# EAGLE design powerboard (EAGLE 7.1.0)
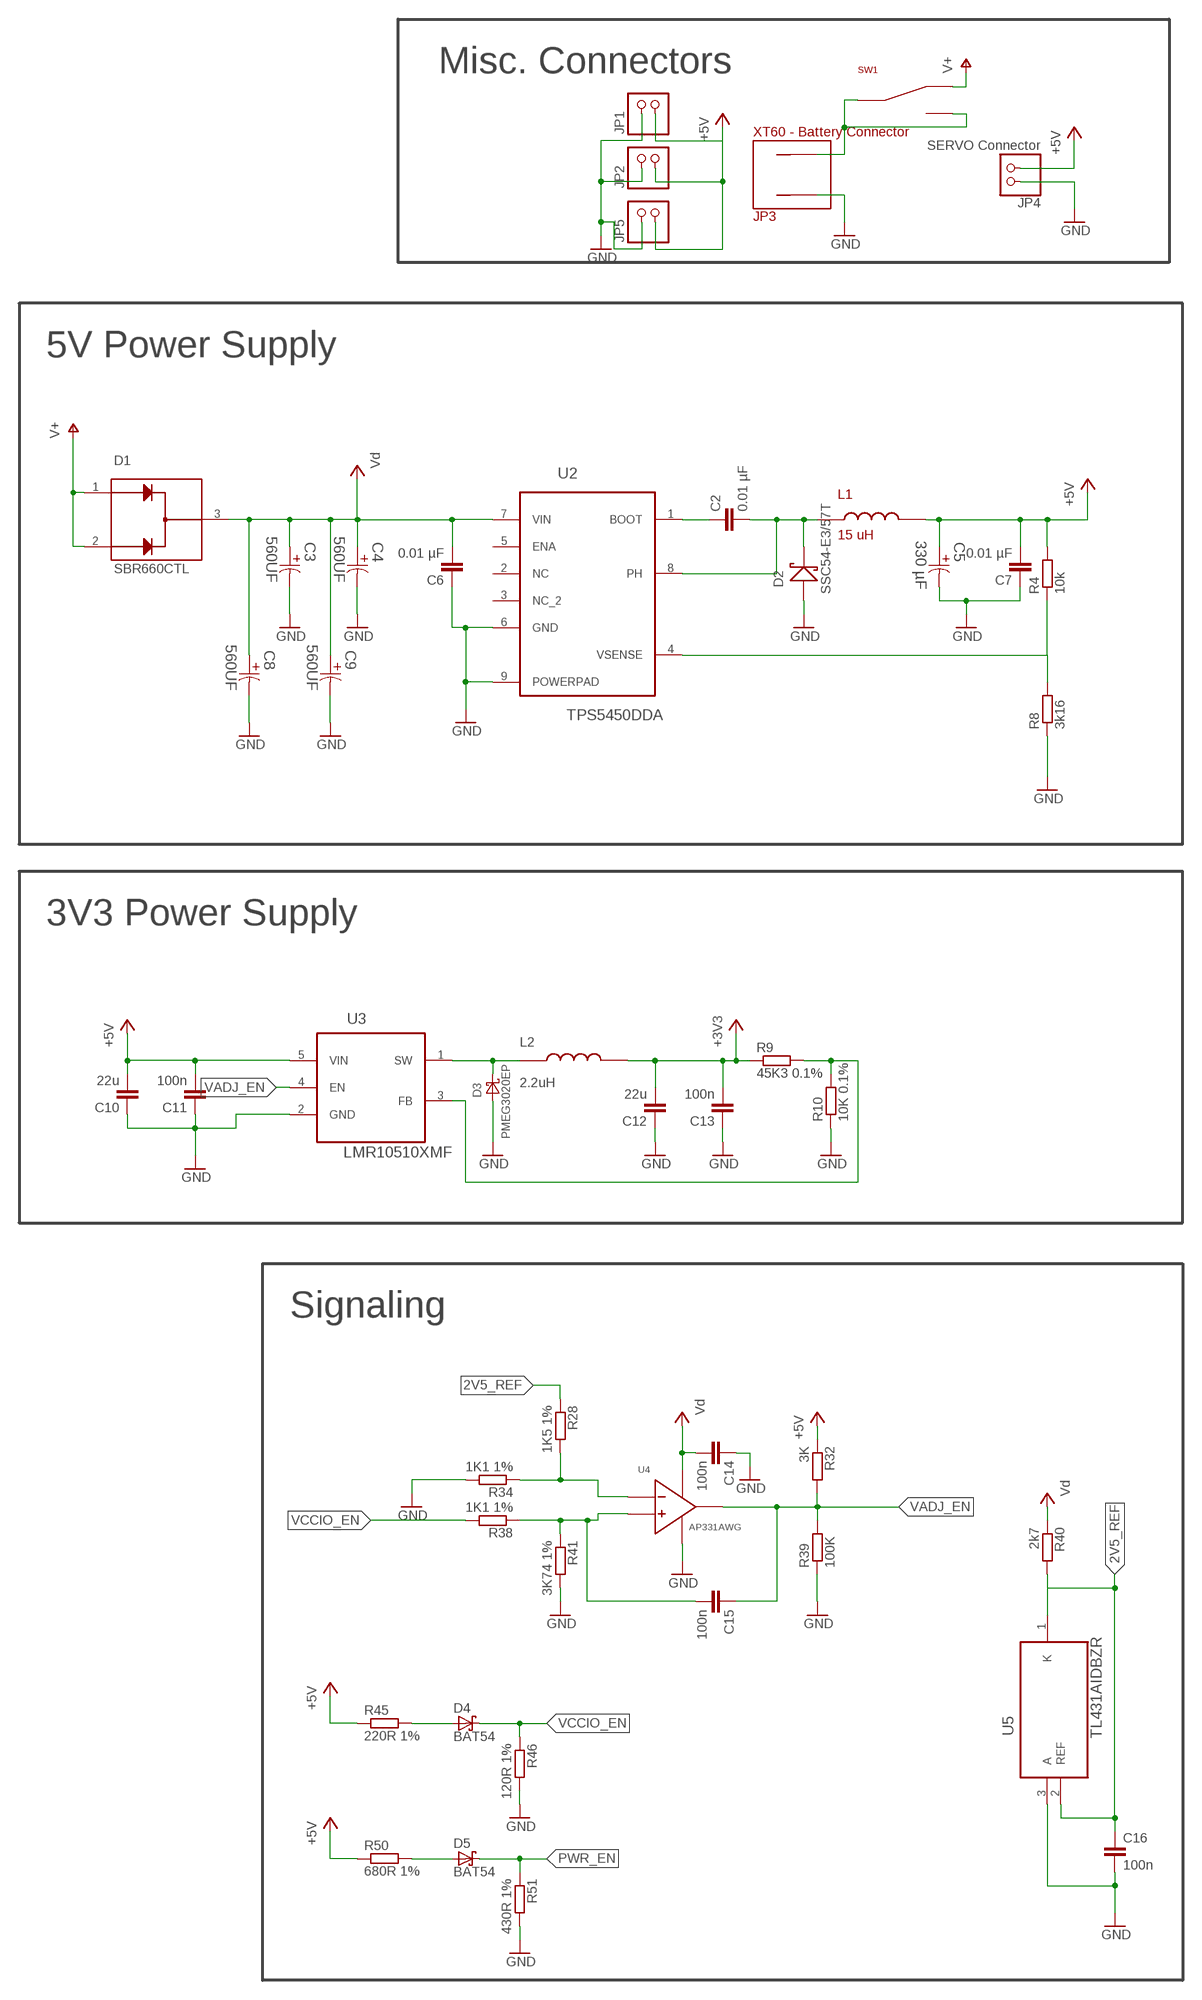
[diagram p0: schematic, sheet 1, part 1 of 2]
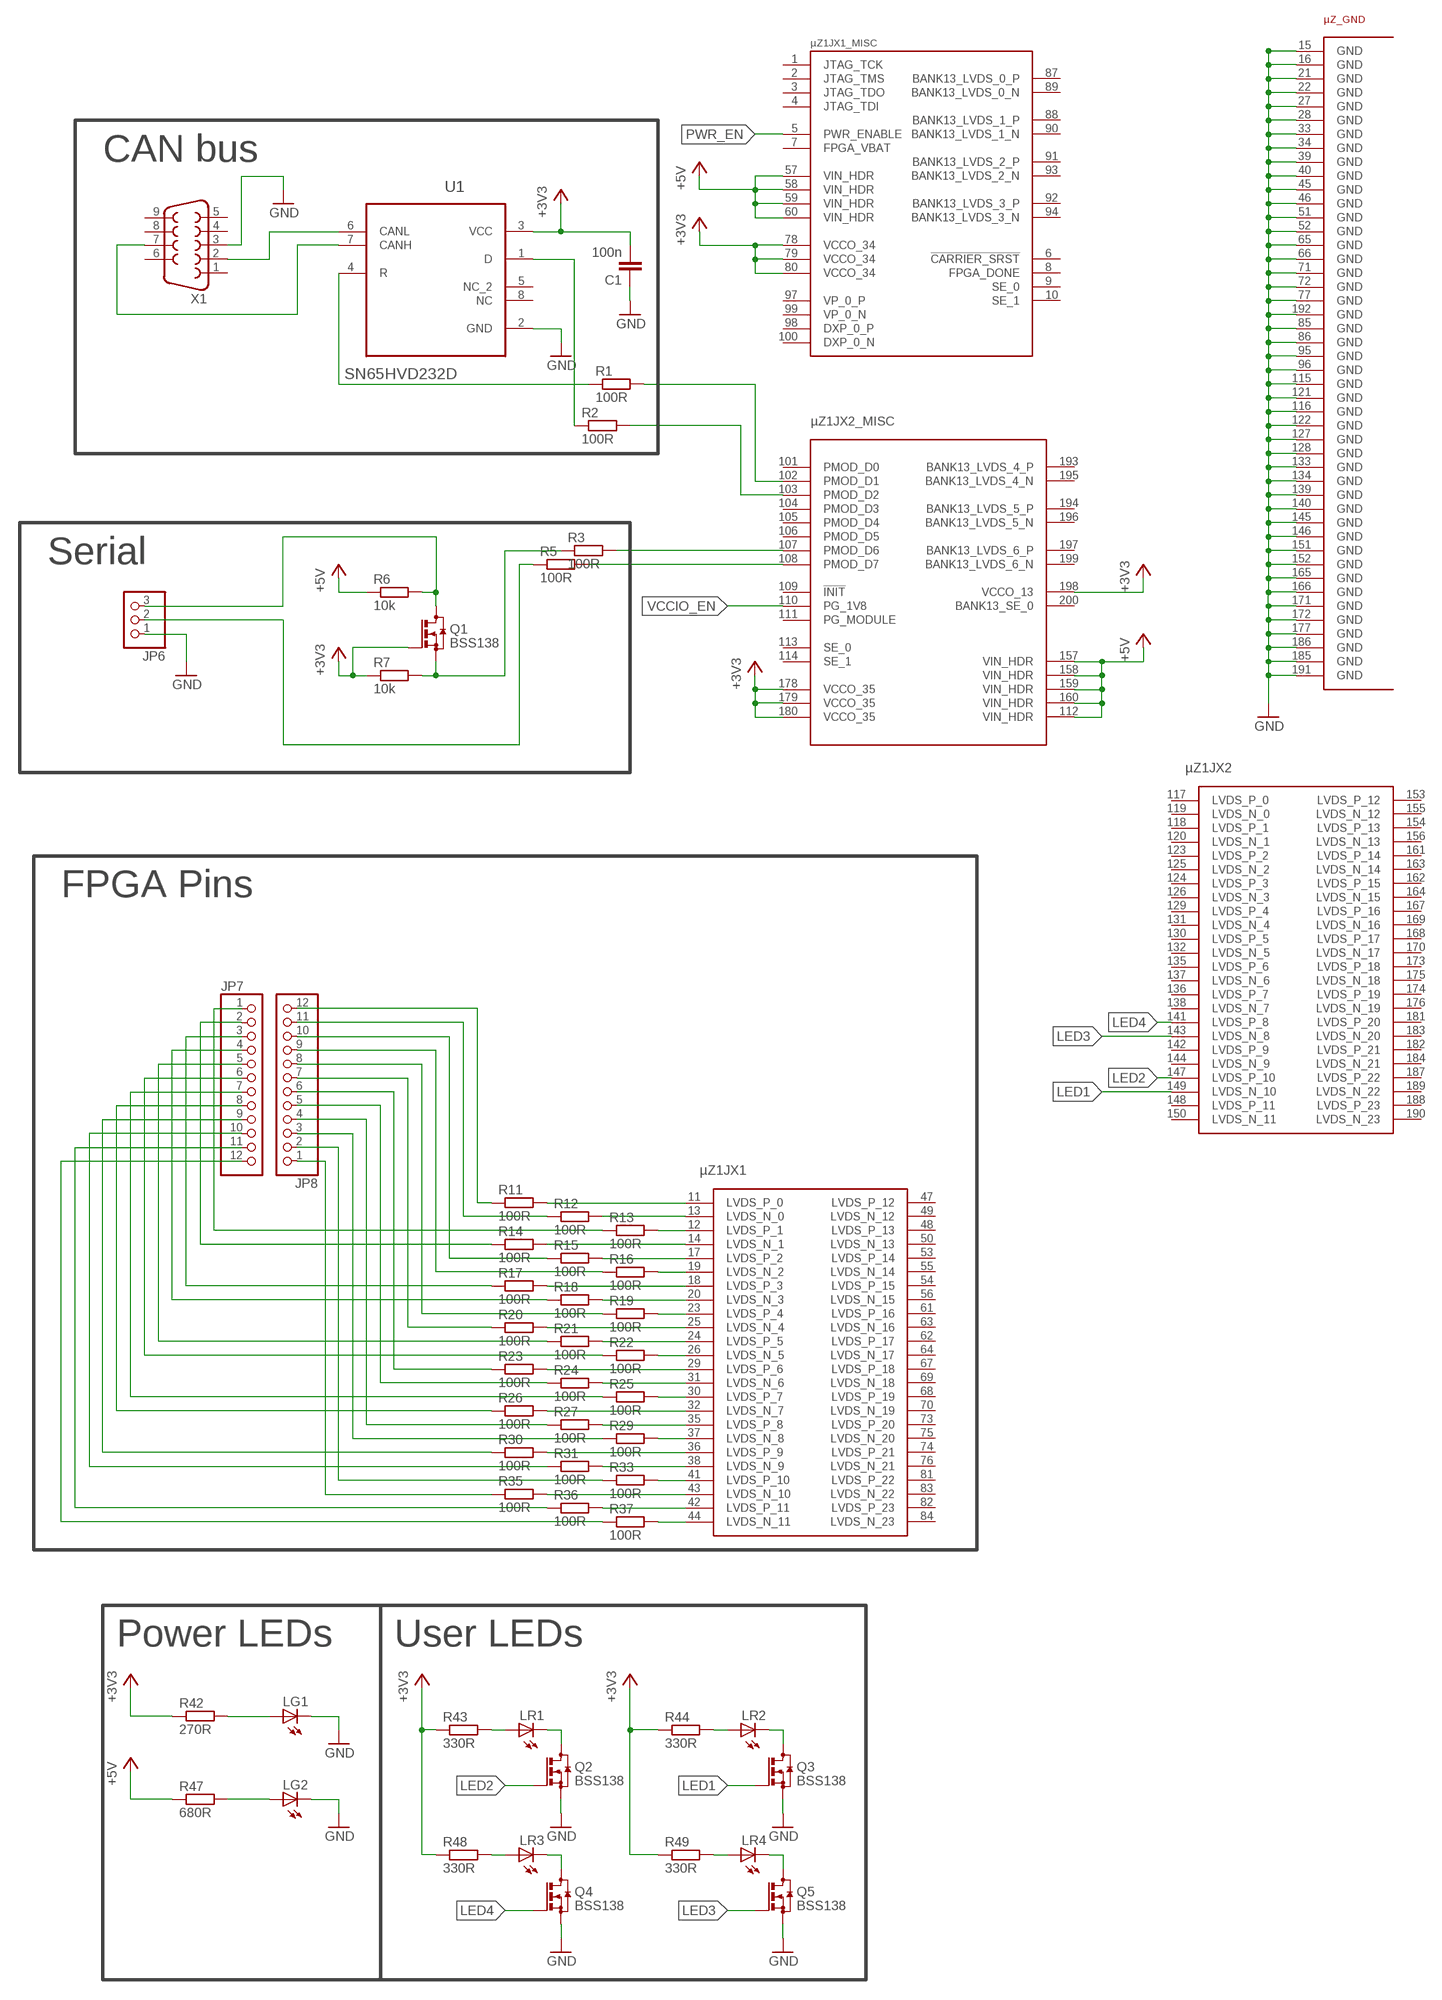
[diagram p1: schematic, sheet 1, part 2 of 2]

## Parts
C1  100n  C-EUC0805  [C0805]
C2  0.01 µF  C-EUC0805  [C0805]
C3  560UF  EEE-FT1V561AP-CASE-G  [CAPAE1030X1050N]
C4  560UF  EEE-FT1V561AP-CASE-G  [CAPAE1030X1050N]
C5  330 µF  EEE-FTC331XAP-CASE-D8  [CAPAE660X800N]
C6  0.01 µF  C-EUC0805  [C0805]
C7  0.01 µF  C-EUC0805  [C0805]
C8  560UF  EEE-FT1V561AP-CASE-G  [CAPAE1030X1050N]
C9  560UF  EEE-FT1V561AP-CASE-G  [CAPAE1030X1050N]
C10  22u  C-EUC0805  [C0805]
C11  100n  C-EUC0805  [C0805]
C12  22u  C-EUC0805  [C0805]
C13  100n  C-EUC0805  [C0805]
C14  100n  C-EUC0805  [C0805]
C15  100n  C-EUC0805  [C0805]
C16  100n  C-EUC0805  [C0805]
D1  SBR660CTL  [TO252]
D2  SSC54-E3/57T  CDBC540-G  [DO-214AB]
D3  PMEG3020EP  DIODE-SCHOTTKY-SOD128  [SOD128]
D4  BAT54  [SOT23]
D5  BAT54  [SOT23]
JP1  PINHD-1X2  [CUST]
JP2  PINHD-1X2  [CUST]
JP3  XT60 - Battery Connector  XT60  [XT60]
JP4  SERVO Connector  PINHD-1X2/90  [1X02/90]
JP5  PINHD-1X2  [CUST]
JP6  PINHD-1X3  [1X03]
JP7  PINHD-1X12  [1X12]
JP8  PINHD-1X12  [1X12]
L1  15 uH  BOURNS-POWER-IND  [BOURNS]
L2  2.2uH  INDZYNQNEW  [INDZYNQ2]
LG1  LEDCHIP-LED0805  [CHIP-LED0805]
LG2  LEDCHIP-LED0805  [CHIP-LED0805]
LR1  LEDCHIP-LED0805  [CHIP-LED0805]
LR2  LEDCHIP-LED0805  [CHIP-LED0805]
LR3  LEDCHIP-LED0805  [CHIP-LED0805]
LR4  LEDCHIP-LED0805  [CHIP-LED0805]
Q1  BSS138  BSS123  [SOT23]
Q2  BSS138  BSS123  [SOT23]
Q3  BSS138  BSS123  [SOT23]
Q4  BSS138  BSS123  [SOT23]
Q5  BSS138  BSS123  [SOT23]
R1  100R  R-EU_R0805  [R0805]
R2  100R  R-EU_R0805  [R0805]
R3  100R  R-EU_R0805  [R0805]
R4  10k  R-EU_R0805  [R0805]
R5  100R  R-EU_R0805  [R0805]
R6  10k  R-EU_R0805  [R0805]
R7  10k  R-EU_R0805  [R0805]
R8  3k16  R-EU_R0805  [R0805]
R9  45K3 0.1%  R-EU_R0805  [R0805]
R10  10K 0.1%  R-EU_R0805  [R0805]
R11  100R  R-EU_R0805  [R0805]
R12  100R  R-EU_R0805  [R0805]
R13  100R  R-EU_R0805  [R0805]
R14  100R  R-EU_R0805  [R0805]
R15  100R  R-EU_R0805  [R0805]
R16  100R  R-EU_R0805  [R0805]
R17  100R  R-EU_R0805  [R0805]
R18  100R  R-EU_R0805  [R0805]
R19  100R  R-EU_R0805  [R0805]
R20  100R  R-EU_R0805  [R0805]
R21  100R  R-EU_R0805  [R0805]
R22  100R  R-EU_R0805  [R0805]
R23  100R  R-EU_R0805  [R0805]
R24  100R  R-EU_R0805  [R0805]
R25  100R  R-EU_R0805  [R0805]
R26  100R  R-EU_R0805  [R0805]
R27  100R  R-EU_R0805  [R0805]
R28  1K5 1%  R-EU_R0805  [R0805]
R29  100R  R-EU_R0805  [R0805]
R30  100R  R-EU_R0805  [R0805]
R31  100R  R-EU_R0805  [R0805]
R32  3K  R-EU_R0805  [R0805]
R33  100R  R-EU_R0805  [R0805]
R34  1K1 1%  R-EU_R0805  [R0805]
R35  100R  R-EU_R0805  [R0805]
R36  100R  R-EU_R0805  [R0805]
R37  100R  R-EU_R0805  [R0805]
R38  1K1 1%  R-EU_R0805  [R0805]
R39  100K  R-EU_R0805  [R0805]
R40  2k7  R-EU_R0805  [R0805]
R41  3K74 1%  R-EU_R0805  [R0805]
R42  270R  R-EU_R0805  [R0805]
R43  330R  R-EU_R0805  [R0805]
R44  330R  R-EU_R0805  [R0805]
R45  220R 1%  R-EU_R0805  [R0805]
R46  120R 1%  R-EU_R0805  [R0805]
R47  680R  R-EU_R0805  [R0805]
R48  330R  R-EU_R0805  [R0805]
R49  330R  R-EU_R0805  [R0805]
R50  680R 1%  R-EU_R0805  [R0805]
R51  430R 1%  R-EU_R0805  [R0805]
SW1  SW  [SW]
U1  SN65HVD232D  [SOIC127P600X175-8N]
U2  TPS5450DDA  [SOIC127P600X170-9N]
U3  LMR10510XMF  [SOT95P290X145-5N]
U4  AP331AWG  [SOT95P290X145-5N]
U5  TL431AIDBZR  [SOT95P230X110-3N]
X1  F09HP  [F09HP]
µZ1  µZTS  [µZ_E]

## Nets
2V5_REF: C16.1 R28.1 R40.2 U5.1(K) U5.2(REF)
+3V3: C1.2 C12.2 C13.2 L2.P$2 Q1.1(G) R7.1 R9.1 R42.1 R43.1 R44.1 R48.1 R49.1 U1.3(VCC) µZ1.78(JX1_MISC:VCCO_34) µZ1.79(JX1_MISC:VCCO_34) µZ1.80(JX1_MISC:VCCO_34) µZ1.178(JX2_MISC:VCCO_35) µZ1.179(JX2_MISC:VCCO_35) µZ1.180(JX2_MISC:VCCO_35) µZ1.198(JX2_MISC:VCCO_13)
+5V: C5.1 C7.2 C10.2 C11.2 JP1.P$2 JP2.P$2 JP4.2 JP5.P$2 L1.P$2 R4.2 R6.1 R32.1 R45.1 R47.1 R50.1 U3.5(VIN) µZ1.57(JX1_MISC:VIN_HDR) µZ1.58(JX1_MISC:VIN_HDR) µZ1.59(JX1_MISC:VIN_HDR) µZ1.60(JX1_MISC:VIN_HDR) µZ1.112(JX2_MISC:VIN_HDR) µZ1.157(JX2_MISC:VIN_HDR) µZ1.158(JX2_MISC:VIN_HDR) µZ1.159(JX2_MISC:VIN_HDR) µZ1.160(JX2_MISC:VIN_HDR)
GND: C1.1 C3.2 C4.2 C5.2 C6.1 C7.1 C8.2 C9.2 C10.1 C11.1 C12.1 C13.1 C14.1 C16.2 D2.A D3.A JP1.P$1 JP2.P$1 JP3.P$2(PLUS) JP4.1 JP5.P$1 JP6.1 LG1.C LG2.C Q2.2(S) Q3.2(S) Q4.2(S) Q5.2(S) R8.1 R10.1 R34.2 R39.1 R41.2 R46.2 R51.2 U1.2(GND) U2.6(GND) U2.9(POWERPAD) U3.2(GND) U4.2(GND) U5.3(A) X1.3 µZ1.15(GND:GND) µZ1.16(GND:GND) µZ1.21(GND:GND) µZ1.22(GND:GND) µZ1.27(GND:GND) µZ1.28(GND:GND) µZ1.33(GND:GND) µZ1.34(GND:GND) µZ1.39(GND:GND) µZ1.40(GND:GND) µZ1.45(GND:GND) µZ1.46(GND:GND) µZ1.51(GND:GND) µZ1.52(GND:GND) µZ1.65(GND:GND) µZ1.66(GND:GND) µZ1.71(GND:GND) µZ1.72(GND:GND) µZ1.77(GND:GND) µZ1.85(GND:GND) µZ1.86(GND:GND) µZ1.95(GND:GND) µZ1.96(GND:GND) µZ1.115(GND:GND) µZ1.116(GND:GND) µZ1.121(GND:GND) µZ1.122(GND:GND) µZ1.127(GND:GND) µZ1.128(GND:GND) µZ1.133(GND:GND) µZ1.134(GND:GND) µZ1.139(GND:GND) µZ1.140(GND:GND) µZ1.145(GND:GND) µZ1.146(GND:GND) µZ1.151(GND:GND) µZ1.152(GND:GND) µZ1.165(GND:GND) µZ1.166(GND:GND) µZ1.171(GND:GND) µZ1.172(GND:GND) µZ1.177(GND:GND) µZ1.185(GND:GND) µZ1.186(GND:GND) µZ1.191(GND:GND) µZ1.192(GND:GND)
LED1: Q3.1(G) µZ1.149(JX2:LVDS_N_10)
LED2: Q2.1(G) µZ1.147(JX2:LVDS_P_10)
LED3: Q5.1(G) µZ1.143(JX2:LVDS_N_8)
LED4: Q4.1(G) µZ1.141(JX2:LVDS_P_8)
N$1: R1.1 U1.4(R)
N$2: JP8.12 R11.1
N$3: U1.6(CANL) X1.2
N$4: R2.1 U1.1(D)
N$5: R22.2 µZ1.26(JX1:LVDS_N_5)
N$6: R21.2 µZ1.24(JX1:LVDS_P_5)
N$7: R20.2 µZ1.25(JX1:LVDS_N_4)
N$8: U1.7(CANH) X1.7
N$9: R1.2 µZ1.102(JX2_MISC:PMOD_D1)
N$10: R2.2 µZ1.103(JX2_MISC:PMOD_D2)
N$11: C2.1 U2.1(BOOT)
N$12: C2.2 D2.C L1.P$1 U2.8(PH)
N$13: D5.1(A) R50.2
N$14: D3.C L2.P$1 U3.1(SW)
N$15: R28.2 R34.1 U4.1(IN-)
N$16: R4.1 R8.2 U2.4(VSENSE)
N$17: R3.2 µZ1.107(JX2_MISC:PMOD_D6)
N$18: R5.2 µZ1.108(JX2_MISC:PMOD_D7)
N$19: R19.2 µZ1.23(JX1:LVDS_P_4)
N$20: JP6.2 R5.1
N$21: R37.2 µZ1.44(JX1:LVDS_N_11)
N$22: R36.2 µZ1.42(JX1:LVDS_P_11)
N$23: R35.2 µZ1.43(JX1:LVDS_N_10)
N$24: R33.2 µZ1.41(JX1:LVDS_P_10)
N$25: R31.2 µZ1.38(JX1:LVDS_N_9)
N$26: R30.2 µZ1.36(JX1:LVDS_P_9)
N$27: R29.2 µZ1.37(JX1:LVDS_N_8)
N$28: R27.2 µZ1.35(JX1:LVDS_P_8)
N$29: R26.2 µZ1.32(JX1:LVDS_N_7)
N$30: R25.2 µZ1.30(JX1:LVDS_P_7)
N$31: R24.2 µZ1.31(JX1:LVDS_N_6)
N$32: R23.2 µZ1.29(JX1:LVDS_P_6)
N$33: JP7.1 R13.1
N$34: JP8.11 R12.1
N$35: JP7.2 R14.1
N$36: JP8.10 R15.1
N$37: JP7.3 R17.1
N$38: JP8.9 R16.1
N$39: JP7.4 R18.1
N$40: JP8.8 R19.1
N$41: JP7.5 R21.1
N$42: JP8.7 R20.1
N$43: JP7.6 R22.1
N$44: JP8.6 R23.1
N$45: Q1.2(S) R3.1 R7.2
N$46: JP6.3 Q1.3(D) R6.2
N$48: R18.2 µZ1.20(JX1:LVDS_N_3)
N$49: R17.2 µZ1.18(JX1:LVDS_P_3)
N$50: JP8.5 R24.1
N$51: JP7.7 R25.1
N$52: JP7.8 R26.1
N$53: JP8.4 R27.1
N$54: JP8.3 R29.1
N$55: JP7.9 R30.1
N$56: JP7.10 R31.1
N$57: JP8.2 R33.1
N$58: R16.2 µZ1.19(JX1:LVDS_N_2)
N$59: R15.2 µZ1.17(JX1:LVDS_P_2)
N$60: R14.2 µZ1.14(JX1:LVDS_N_1)
N$61: R13.2 µZ1.12(JX1:LVDS_P_1)
N$62: R12.2 µZ1.13(JX1:LVDS_N_0)
N$63: R11.2 µZ1.11(JX1:LVDS_P_0)
N$64: JP8.1 R35.1
N$65: JP7.11 R36.1
N$66: JP7.12 R37.1
N$67: D4.1(A) R45.2
N$69: LG2.A R47.2
N$71: LR2.A R44.2
N$72: LG1.A R42.2
N$73: LR1.A R43.2
N$74: LR4.A R49.2
N$75: LR3.A R48.2
N$76: LR3.C Q4.3(D)
N$77: LR1.C Q2.3(D)
N$78: LR2.C Q3.3(D)
N$79: LR4.C Q5.3(D)
N$80: R9.2 R10.2 U3.3(FB)
N$81: C15.2 R38.1 R41.1 U4.3(IN+)
N$93: JP3.P$1(MINUS) SW1.P$1 SW1.P$3
PWR_EN: D5.3(C) R51.1 µZ1.5(JX1_MISC:PWR_ENABLE)
V+: D1.1 D1.2 SW1.P$2
VADJ_EN: C15.1 R32.2 R39.2 U3.4(EN) U4.4(OUT)
VCCIO_EN: D4.3(C) R38.2 R46.1 µZ1.110(JX2_MISC:PG_1V8)
VD: C3.1 C4.1 C6.2 C8.1 C9.1 C14.2 D1.3 R40.1 U2.7(VIN) U4.5(VCC) ; supply symbol labelled Vd
Unconnected: U1.5(NC_2) U1.8(NC) U2.2(NC) U2.3(NC_2) U2.5(ENA) X1.1 X1.4 X1.5 X1.6 X1.8 X1.9 µZ1.1(JX1_MISC:JTAG_TCK) µZ1.2(JX1_MISC:JTAG_TMS) µZ1.3(JX1_MISC:JTAG_TDO) µZ1.4(JX1_MISC:JTAG_TDI) µZ1.6(JX1_MISC:!CARRIER_SRST) µZ1.8(JX1_MISC:FPGA_DONE) µZ1.9(JX1_MISC:SE_0) µZ1.10(JX1_MISC:SE_1) µZ1.47(JX1:LVDS_P_12) µZ1.48(JX1:LVDS_P_13) µZ1.49(JX1:LVDS_N_12) µZ1.50(JX1:LVDS_N_13) µZ1.53(JX1:LVDS_P_14) µZ1.54(JX1:LVDS_P_15) µZ1.55(JX1:LVDS_N_14) µZ1.56(JX1:LVDS_N_15) µZ1.61(JX1:LVDS_P_16) µZ1.62(JX1:LVDS_P_17) µZ1.63(JX1:LVDS_N_16) µZ1.64(JX1:LVDS_N_17) µZ1.67(JX1:LVDS_P_18) µZ1.68(JX1:LVDS_P_19) µZ1.69(JX1:LVDS_N_18) µZ1.70(JX1:LVDS_N_19) µZ1.73(JX1:LVDS_P_20) µZ1.74(JX1:LVDS_P_21) µZ1.75(JX1:LVDS_N_20) µZ1.76(JX1:LVDS_N_21) µZ1.81(JX1:LVDS_P_22) µZ1.82(JX1:LVDS_P_23) µZ1.83(JX1:LVDS_N_22) µZ1.84(JX1:LVDS_N_23) µZ1.87(JX1_MISC:BANK13_LVDS_0_P) µZ1.88(JX1_MISC:BANK13_LVDS_1_P) µZ1.89(JX1_MISC:BANK13_LVDS_0_N) µZ1.90(JX1_MISC:BANK13_LVDS_1_N) µZ1.91(JX1_MISC:BANK13_LVDS_2_P) µZ1.92(JX1_MISC:BANK13_LVDS_3_P) µZ1.93(JX1_MISC:BANK13_LVDS_2_N) µZ1.94(JX1_MISC:BANK13_LVDS_3_N) µZ1.97(JX1_MISC:VP_0_P) µZ1.98(JX1_MISC:DXP_0_P) µZ1.99(JX1_MISC:VP_0_N) µZ1.100(JX1_MISC:DXP_0_N) µZ1.101(JX2_MISC:PMOD_D0) µZ1.104(JX2_MISC:PMOD_D3) µZ1.105(JX2_MISC:PMOD_D4) µZ1.106(JX2_MISC:PMOD_D5) µZ1.109(JX2_MISC:!INIT) µZ1.111(JX2_MISC:PG_MODULE) µZ1.113(JX2_MISC:SE_0) µZ1.114(JX2_MISC:SE_1) µZ1.117(JX2:LVDS_P_0) µZ1.118(JX2:LVDS_P_1) µZ1.119(JX2:LVDS_N_0) µZ1.120(JX2:LVDS_N_1) µZ1.123(JX2:LVDS_P_2) µZ1.124(JX2:LVDS_P_3) µZ1.125(JX2:LVDS_N_2) µZ1.126(JX2:LVDS_N_3) µZ1.129(JX2:LVDS_P_4) µZ1.130(JX2:LVDS_P_5) µZ1.131(JX2:LVDS_N_4) µZ1.132(JX2:LVDS_N_5) µZ1.135(JX2:LVDS_P_6) µZ1.136(JX2:LVDS_P_7) µZ1.137(JX2:LVDS_N_6) µZ1.138(JX2:LVDS_N_7) µZ1.142(JX2:LVDS_P_9) µZ1.144(JX2:LVDS_N_9) µZ1.148(JX2:LVDS_P_11) µZ1.150(JX2:LVDS_N_11) µZ1.153(JX2:LVDS_P_12) µZ1.154(JX2:LVDS_P_13) µZ1.155(JX2:LVDS_N_12) µZ1.156(JX2:LVDS_N_13) µZ1.161(JX2:LVDS_P_14) µZ1.162(JX2:LVDS_P_15) µZ1.163(JX2:LVDS_N_14) µZ1.164(JX2:LVDS_N_15) µZ1.167(JX2:LVDS_P_16) µZ1.168(JX2:LVDS_P_17) µZ1.169(JX2:LVDS_N_16) µZ1.170(JX2:LVDS_N_17) µZ1.173(JX2:LVDS_P_18) µZ1.174(JX2:LVDS_P_19) µZ1.175(JX2:LVDS_N_18) µZ1.176(JX2:LVDS_N_19) µZ1.181(JX2:LVDS_P_20) µZ1.182(JX2:LVDS_P_21) µZ1.183(JX2:LVDS_N_20) µZ1.184(JX2:LVDS_N_21) µZ1.187(JX2:LVDS_P_22) µZ1.188(JX2:LVDS_P_23) µZ1.189(JX2:LVDS_N_22) µZ1.190(JX2:LVDS_N_23) µZ1.193(JX2_MISC:BANK13_LVDS_4_P) µZ1.194(JX2_MISC:BANK13_LVDS_5_P) µZ1.195(JX2_MISC:BANK13_LVDS_4_N) µZ1.196(JX2_MISC:BANK13_LVDS_5_N) µZ1.197(JX2_MISC:BANK13_LVDS_6_P) µZ1.199(JX2_MISC:BANK13_LVDS_6_N) µZ1.200(JX2_MISC:BANK13_SE_0)

## Notes on the sheet
- Misc. Connectors
- CAN bus
- 5V Power Supply
- Serial
- FPGA Pins
- 3V3 Power Supply
- Signaling
- Power LEDs | User LEDs

## Power pins joined to a net without a drawn wire
FPGA_VBAT: µZ1.7(JX1_MISC:FPGA_VBAT)

## Library data of the parts
C1 C2 C6 C7 C10-C16 = resistor:C-EU: CAPACITOR, European symbol; SPICEPREFIX: C
C3 C4 C8 C9 = Panasonic-EEEFT_EEEH:EEE-: Aluminum Electrolytic Capacitors,Surface Mount Type; LINK: http://cz.farnell.com/panasonic-electronic-components/eeeft1v561ap/cap-alu-elec-560uf-35v-smd/dp/1868420?jsValue=http%3A%2F%2Fwww.farnell.com%2Fcad%2F1703921.zip&jsAction=cad&skipCache=true; MPN: EEE-FT1V561AP; OC_FARNELL: 1868420; OC_NEWARK: 31T8191; PACKAGE: CASE-G; SUPPLIER: PANASONIC; TOLERANCE: ±20 %; VOLTAGERATING: 35V
C5 = Panasonic-EEEFT_EEEH:EEE-: Aluminum Electrolytic Capacitors,Surface Mount Type; LINK: http://cz.farnell.com/panasonic-electronic-components/eeeftc331xap/cap-alu-elec-330uf-16v-smd/dp/2065972; MPN: EEE-FTC331XAP; OC_FARNELL: 2065972; OC_NEWARK: 73T9143; PACKAGE: CASE-D8; SUPPLIER: PANASONIC; TOLERANCE: ±20 %; VALUE: 330UF; VOLTAGERATING: 16V
D1 = to252:SBR660CTL; LINK: http://cz.farnell.com/diodes-inc/sbr660ctl-13/diode-sbr-60v-6a-dpak/dp/2113933RL
D2 = MyDiode:CDBC5*: Schottky Diode SMD Schottky Barrier Rectifier Documentation Datasheet <http://www.comchiptech.com/cms/UserFiles/CDBC520-G%20Thru936981.%20CDBC5100-G%20RevC.pdf> Features Ideal for surface mount applications Easy pick and place Plastic package has Underwriters Lab. flammability classification 94V-0. Built-in strain relief Low forward voltage drop. Mechanical Data Case: JEDEC DO-214AB, molded plastic. Terminals: solderable mer MIL-STD-750, method 2026. Polarity: Color band denotes cathode end. Approx. weight: 0.21 grams; CAPACITANCE: -; CURRENT-AVERAGE_RECTIFIED: 5A; CURRENT-REVERSE_LEAKAGE: 500uA @ 40V; DESCRIPTION: DIODE SCHOTTKY 40V 5A DO214AB; DIODE_TYPE: Schottky; DOCUMENTATION_LINK: <a href="http://www.comchiptech.com/cms/UserFiles/CDBC520-G%20Thru936981.%20CDBC5100-G%20RevC.pdf">Datasheet</a>; DOCUMENTATION_URL: http://www.comchiptech.com/cms/UserFiles/CDBC520-G%20Thru936981.%20CDBC5100-G%20RevC.pdf; LINK: http://cz.farnell.com/vishay/ssc54-e3-57t/diode-schottky-5a-40v-smc/dp/1336559; MANUFACTURER: Comchip Technology; MOUNTING_TYPE: Surface Mount; OPERATING_TEMPERATURE-JUNCTION: -40C ~ 125C; PACKAGE: DO-214AB, SMC; PART_NUMBER: CDBC540-G; REVERSE_RECOVERY-TIME: -; SERIES: -; SPEED: Fast Recovery =< 500ns, > 200mA (Io); SUPPLIER_DEVICE_PACKAGE: DO-214AB, (SMC); SUPPLIER_ITEM_LINK: <a href="http://www.digikey.com/product-detail/en/CDBC540-G/641-1126-1-ND/1559087">Details</a>; SUPPLIER_ITEM_NUMBER: 641-1126-1-ND; SUPPLIER_ITEM_URL: http://www.digikey.com/product-detail/en/CDBC540-G/641-1126-1-ND/1559087; SUPPLIER_LINK: <a href="http://www.digikey.com">Home Page</a>; SUPPLIER_NAME: Digi-Key; SUPPLIER_URL: http://www.digikey.com; VOLTAGE-DC_REVERSE: 40V; VOLTAGE-FORWARD: 550mV @ 5A
D3 = diodes:DIODE-SCHOTTKY-: SCHOTTKY DIODE; LINK: http://cz.farnell.com/nxp/pmeg3020ep/diode-schott-rect-30v-2a-sod128/dp/1972722
D4 D5 = diode:BAT54: Schottky Diodes Source: Fairchild .. BAT54.pdf; LINK: http://cz.farnell.com/fairchild-semiconductor/bat54/diode-schottky-0-2a-30v-sot-23/dp/1467516
JP1 JP2 JP5 = pinhead:PINHD-1X2: PIN HEADER; LINK: http://www.gme.cz/konektor-se-zamkem-psh02-02p-p800-093
JP3 = ARDUINO:XT60
JP4 = pinhead:PINHD-1X2: PIN HEADER; LINK: http://www.gme.cz/konektor-se-zamkem-psh02-02w-p800-094
JP6 = pinhead:PINHD-1X3: PIN HEADER
JP7 JP8 = pinhead:PINHD-1X12: PIN HEADER
L1 = PTO:BOURNS-POWER-IND; LINK: http://cz.farnell.com/bourns/srr1280a-150m/inductor-power-15uh-5a-20/dp/2374154
L2 = ARDUINO:INDZYNQ
LG1 LG2 = led:LED: LED OSRAM: - CHIPLED LG R971, LG N971, LY N971, LG Q971, LY Q971, LO R971, LY R971 LH N974, LH R974 LS Q976, LO Q976, LY Q976 LO Q996 - Hyper CHIPLED LW Q18S LB Q993, LB Q99A, LB R99A - SideLED LS A670, LO A670, LY A670, LG A670, LP A670 LB A673, LV A673, LT A673, LW A673 LH A674 LY A675 LS A676, LA A676, LO A676, LY A676, LW A676 LS A679, LY A679, LG A679 - Hyper Micro SIDELED® LS Y876, LA Y876, LO Y876, LY Y876 LT Y87S - SmartLED LW L88C, LW L88S LB L89C, LB L89S, LG L890 LS L89K, LO L89K, LY L89K LS L896, LA L896, LO L896, LY L896 - TOPLED LS T670, LO T670, LY T670, LG T670, LP T670 LSG T670, LSP T670, LSY T670, LOP T670, LYG T670 LG T671, LOG T671, LSG T671 LB T673, LV T673, LT T673, LW T673 LH T674 LS T676, LA T676, LO T676, LY T676, LB T676, LH T676, LSB T676, LW T676 LB T67C, LV T67C, LT T67C, LS T67K, LO T67K, LY T67K, LW E67C LS E67B, LA E67B, LO E67B, LY E67B, LB E67C, LV E67C, LT E67C LW T67C LS T679, LY T679, LG T679 LS T770, LO T770, LY T770, LG T770, LP T770 LB T773, LV T773, LT T773, LW T773 LH T774 LS E675, LA E675, LY E675, LS T675 LS T776, LA T776, LO T776, LY T776, LB T776 LHGB T686 LT T68C, LB T68C - Hyper Mini TOPLED® LB M676 - Mini TOPLED Santana® LG M470 LS M47K, LO M47K, LY M47K Source: http://www.osram.convergy.de LUXEON: - LUMILED® LXK2-PW12-R00, LXK2-PW12-S00, LXK2-PW14-U00, LXK2-PW14-V00 LXK2-PM12-R00, LXK2-PM12-S00, LXK2-PM14-U00 LXK2-PE12-Q00, LXK2-PE12-R00, LXK2-PE12-S00, LXK2-PE14-T00, LXK2-PE14-U00 LXK2-PB12-K00, LXK2-PB12-L00, LXK2-PB12-M00, LXK2-PB14-N00, LXK2-PB14-P00, LXK2-PB14-Q00 LXK2-PR12-L00, LXK2-PR12-M00, LXK2-PR14-Q00, LXK2-PR14-R00 LXK2-PD12-Q00, LXK2-PD12-R00, LXK2-PD12-S00 LXK2-PH12-R00, LXK2-PH12-S00 LXK2-PL12-P00, LXK2-PL12-Q00, LXK2-PL12-R00 Source: www.luxeon.com KINGBRIGHT: KA-3528ASYC Source: www.kingbright.com; LINK: http://cz.farnell.com/multicomp/mcl-s270gc/led-0805-green-10mcd-570nm/dp/1581242RL
LR1-LR4 = led:LED: LED OSRAM: - CHIPLED LG R971, LG N971, LY N971, LG Q971, LY Q971, LO R971, LY R971 LH N974, LH R974 LS Q976, LO Q976, LY Q976 LO Q996 - Hyper CHIPLED LW Q18S LB Q993, LB Q99A, LB R99A - SideLED LS A670, LO A670, LY A670, LG A670, LP A670 LB A673, LV A673, LT A673, LW A673 LH A674 LY A675 LS A676, LA A676, LO A676, LY A676, LW A676 LS A679, LY A679, LG A679 - Hyper Micro SIDELED® LS Y876, LA Y876, LO Y876, LY Y876 LT Y87S - SmartLED LW L88C, LW L88S LB L89C, LB L89S, LG L890 LS L89K, LO L89K, LY L89K LS L896, LA L896, LO L896, LY L896 - TOPLED LS T670, LO T670, LY T670, LG T670, LP T670 LSG T670, LSP T670, LSY T670, LOP T670, LYG T670 LG T671, LOG T671, LSG T671 LB T673, LV T673, LT T673, LW T673 LH T674 LS T676, LA T676, LO T676, LY T676, LB T676, LH T676, LSB T676, LW T676 LB T67C, LV T67C, LT T67C, LS T67K, LO T67K, LY T67K, LW E67C LS E67B, LA E67B, LO E67B, LY E67B, LB E67C, LV E67C, LT E67C LW T67C LS T679, LY T679, LG T679 LS T770, LO T770, LY T770, LG T770, LP T770 LB T773, LV T773, LT T773, LW T773 LH T774 LS E675, LA E675, LY E675, LS T675 LS T776, LA T776, LO T776, LY T776, LB T776 LHGB T686 LT T68C, LB T68C - Hyper Mini TOPLED® LB M676 - Mini TOPLED Santana® LG M470 LS M47K, LO M47K, LY M47K Source: http://www.osram.convergy.de LUXEON: - LUMILED® LXK2-PW12-R00, LXK2-PW12-S00, LXK2-PW14-U00, LXK2-PW14-V00 LXK2-PM12-R00, LXK2-PM12-S00, LXK2-PM14-U00 LXK2-PE12-Q00, LXK2-PE12-R00, LXK2-PE12-S00, LXK2-PE14-T00, LXK2-PE14-U00 LXK2-PB12-K00, LXK2-PB12-L00, LXK2-PB12-M00, LXK2-PB14-N00, LXK2-PB14-P00, LXK2-PB14-Q00 LXK2-PR12-L00, LXK2-PR12-M00, LXK2-PR14-Q00, LXK2-PR14-R00 LXK2-PD12-Q00, LXK2-PD12-R00, LXK2-PD12-S00 LXK2-PH12-R00, LXK2-PH12-S00 LXK2-PL12-P00, LXK2-PL12-Q00, LXK2-PL12-R00 Source: www.luxeon.com KINGBRIGHT: KA-3528ASYC Source: www.kingbright.com; LINK: http://cz.farnell.com/lumex/sml-lxt0805srw-tr/led-red-1-25mm-21mcd-660nm/dp/2062238
Q1-Q5 = transistor-small-signal:BSS123: N-CHANNEL MOS FET; LINK: http://cz.farnell.com/nxp/bss138pw/mosfet-n-ch-60v-0-32a-sot323/dp/1907611
R1-R51 = resistor:R-EU_: RESISTOR, European symbol
SW1 = ARDUINOold:SW; LINK: http://cz.farnell.com/c-k-components/l102011ms02q/switch-slide-spdt/dp/2435160
U1 = PTO:SN65HVD232D: 3.3-V CAN TRANSCEIVERS; LINK: http://cz.farnell.com/texas-instruments/sn65hvd232d/ic-can-transceiver-1mbps-8soic/dp/1103107; MPN: SN65HVD232D; OC_FARNELL: 1103107; OC_NEWARK: 35K4890; PACKAGE: SOIC-8; SUPPLIER: Texas Instruments
U2 = PTO:TPS5450DDA: 5-A, WIDE INPUT RANGE, STEP-DOWN SWIFT CONVERTER; LINK: http://cz.farnell.com/texas-instruments/tps5450dda/ic-converter-switching-step-down/dp/1564960; MPN: TPS5450DDA; OC_FARNELL: 1564960; OC_NEWARK: 37M0059; PACKAGE: SOIC-8; SUPPLIER: TEXAS INSTRUMENTS
U3 = reg3V3:LMR10510XMF: IC, SIMPLE SWITCHER 5.5Vin, 1A Step-Down Voltage Regulator in SOT-23-5; LINK: http://cz.farnell.com/texas-instruments/lmr10510xnopb/buck-1a-5-5vin/dp/2064685; MPN: LMR10510XMF; OC_FARNELL: 2064685; OC_NEWARK: 75T7387; PACKAGE: SOT-23-5; SUPPLIER: TEXAS INSTRUMENTS
U4 = AP331AWG:AP331AWG; LINK: http://cz.farnell.com/texas-instruments/lmr10510xnopb/buck-1a-5-5vin/dp/2064685?jsValue=http%3A%2F%2Fwww.farnell.com%2Fcad%2F1757176.zip&jsAction=cad&skipCache=true
U5 = TL431:TL431AIDBZR: Adjustable precision shunt regulator,Reference voltage tolerance 1 %, SOT-23-3; LINK: http://cz.farnell.com/nxp/tl431aidbzr/voltage-ref-shunt-2-495v-36v-sot/dp/2095465?jsValue=http%3A%2F%2Fwww.farnell.com%2Fcad%2F1722162.zip&jsAction=cad&skipCache=true; MPN: TL431AIDBZR; OC_FARNELL: 2095465; OC_NEWARK: 91T5101; PACKAGE: SOT-23-3; SUPPLIER: NXP
X1 = con-subd:F09: HARTING SUB-D; LINK: http://cz.farnell.com/te-connectivity-amp/1-1634580-2/connector-d-sub-plug-tht-r-a-9way/dp/8391246
µZ1 = MicroZed:µZ: MicroZed board Tech H : hole version Tech TS : Theaded spacers version; LINK: http://cz.farnell.com/fci/61083-104400lf/plug-smd-0-8mm-100way/dp/1103987

## Board
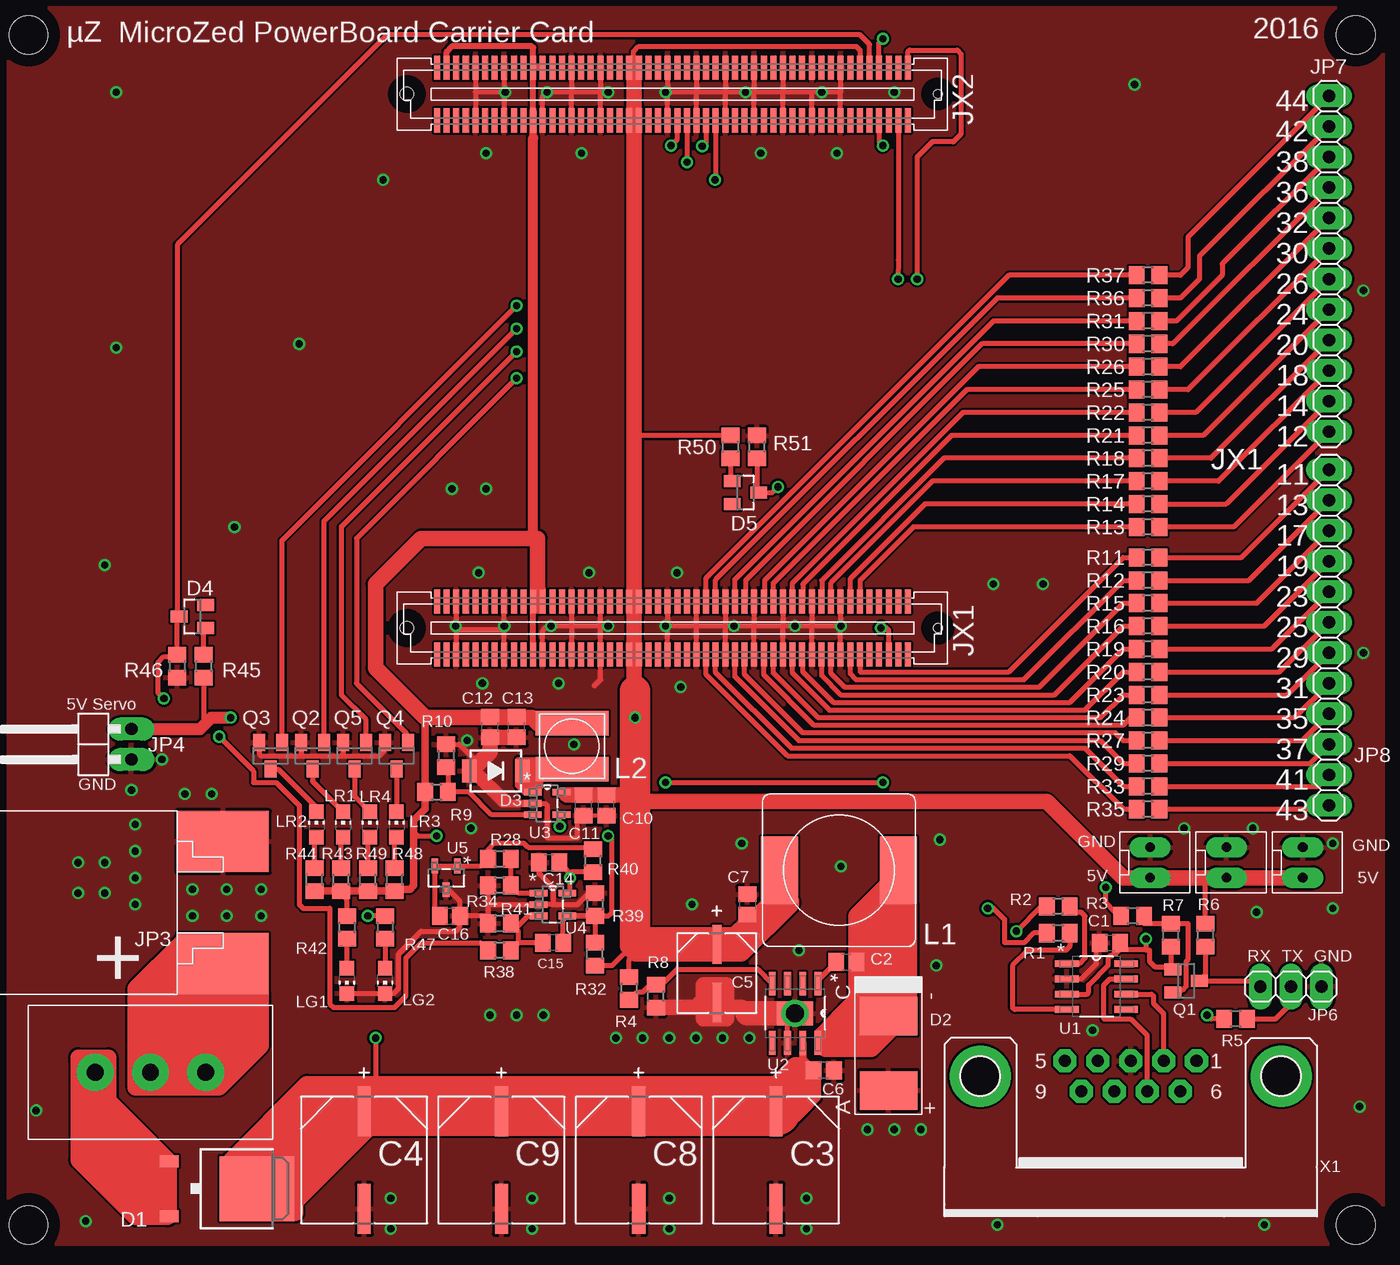
[diagram p2: board, top side]
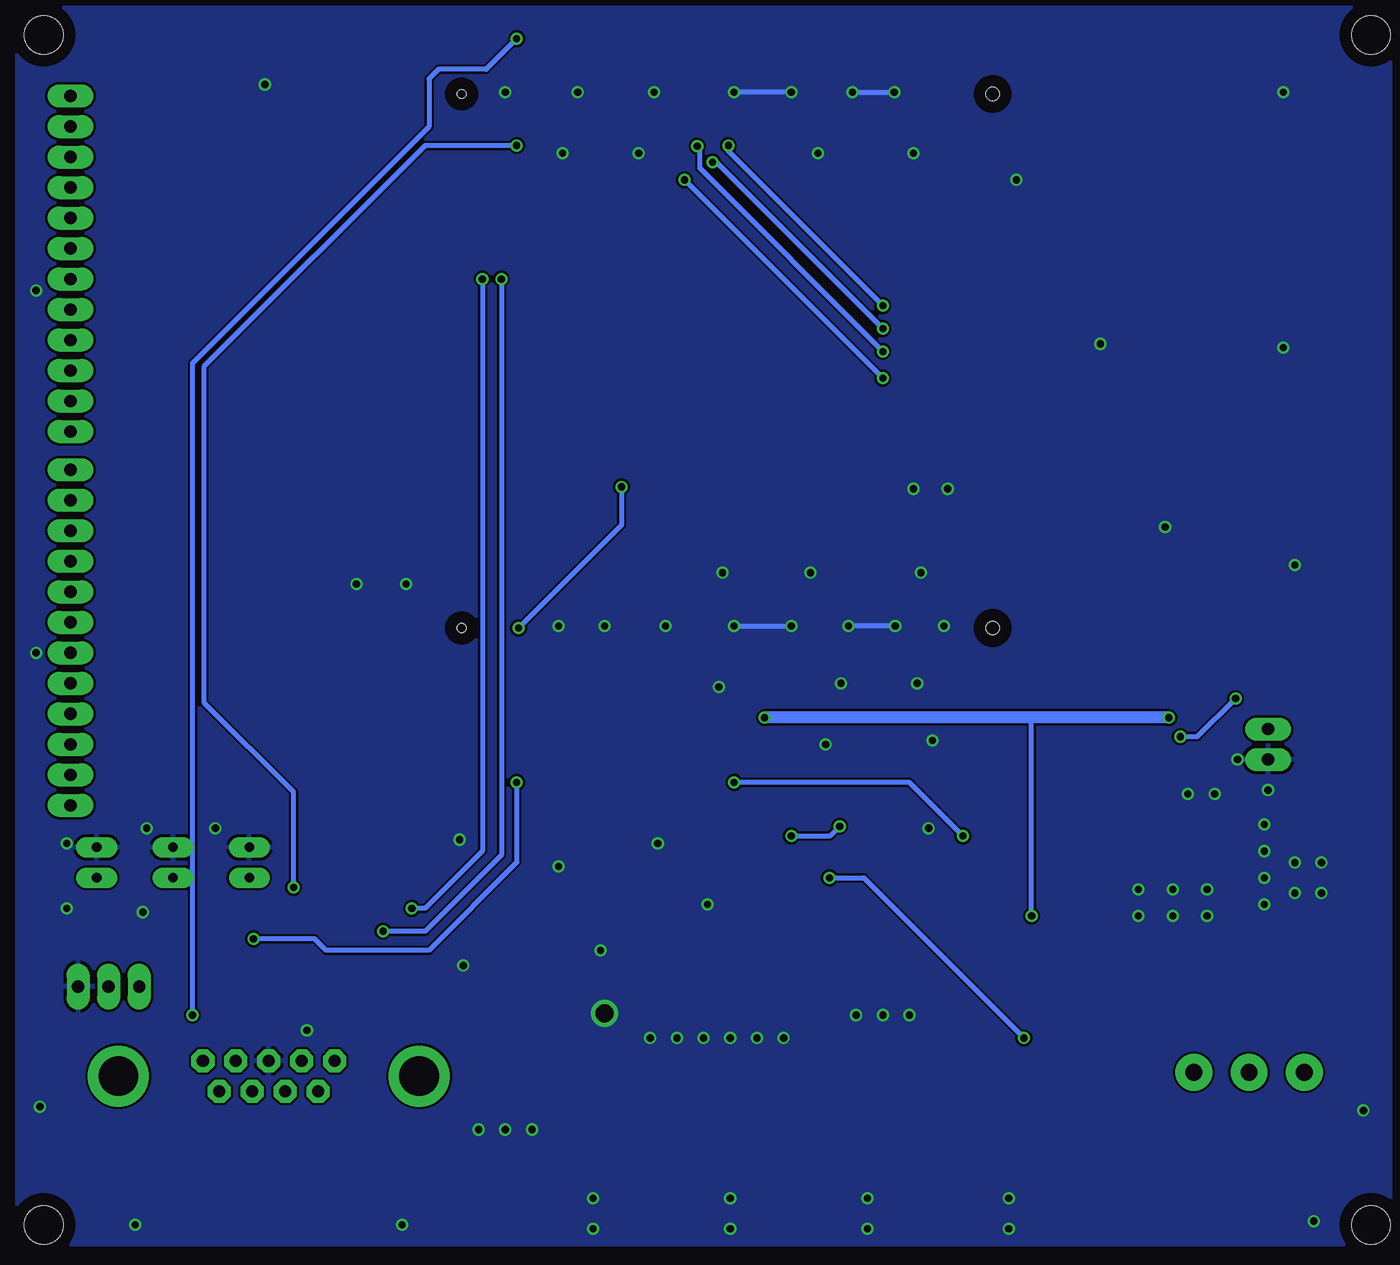
[diagram p3: board, bottom side, seen from below]

No outline drawn. Coordinates in mm, seen from the top.
Copper layers (1*16): Top 0.035mm / dielectric 1.5mm / Bottom 0.035mm
Design rules "default *": minimum track width 10mil, minimum drill 20mil, track to track 7.5mil, track to pad 7.5mil, pad to pad 7.5mil, via to via 7.5mil, smd to smd 0mil, copper to edge 40mil, drill to drill 8mil, minimum pad ring 18mil, minimum via ring 8mil, stop-mask expansion 4mil, vias tented up to drill 0mil, thermal gap 10mil
Holes 3.2 mm at 113.67,3.17 113.67,102.23 3.17,102.23 3.17,3.17

### Footprints (pad centres in the part's own frame; a part is rotated, then mirrored left to right if it is on the bottom)
C0805 = smd 1.3 x 1.5: 1 -0.85,0; 2 0.85,0
CAPAE1030X1050N = smd 4.166 x 1.092: 1 -4.064,0; 2 4.064,0
CAPAE660X800N = smd 3.251 x 0.762: 1 -2.413,0; 2 2.413,0
TO252 = smd 1 x 1.6: 1 -2.28,-4.8; 2 2.28,-4.8 | smd 5.4 x 6.2: 3 0,2.5
DO-214AB = smd 3.2 x 4.8: A -3.1,0; C 3.1,0
SOD128 = smd 1.2 x 1.9: A 2.2,0; C -2.2,0
SOT23 = smd 1 x 1.4: 1 -0.95,-1.1; 2 0.95,-1.1; 3 0,1.1
CUST = drill 0.8 long: P$1 -1.27,0.508; P$2 1.27,0.508
XT60 = smd 7.62 x 5.08: P$1 -5.08,5.08; P$2 -5.08,-5.08
1X02/90 = drill 1.016 long: 1 -1.27,-3.81; 2 1.27,-3.81
1X03 = drill 1.016 long: 1 -2.54,0; 2 0,0; 3 2.54,0
1X12 = drill 1.016 long: 1 -13.97,0; 2 -11.43,0; 3 -8.89,0; 4 -6.35,0; 5 -3.81,0; 6 -1.27,0; 7 1.27,0; 8 3.81,0; 9 6.35,0; 10 8.89,0; 11 11.43,0; 12 13.97,0
BOURNS = smd 3.048 x 5.588: P$1 -4.953,0; P$2 4.953,0
INDZYNQ2 = smd 6.096 x 2.032: P$1 0.794,1.111; P$2 0.794,-2.699
CHIP-LED0805 = smd 1.2 x 1.2: A 0,-1.05; C 0,1.05
R0805 = smd 1.3 x 1.5: 1 -0.95,0; 2 0.95,0
SW = drill 1.4 pad 3.048: P$1 0,0; P$2 4.597,0; P$3 -4.597,0
SOIC127P600X175-8N = smd 1.981 x 0.559: 1 -2.464,1.905; 2 -2.464,0.635; 3 -2.464,-0.635; 4 -2.464,-1.905; 5 2.464,-1.905; 6 2.464,-0.635; 7 2.464,0.635; 8 2.464,1.905
SOIC127P600X170-9N = smd 1.981 x 0.559: 1 -2.464,1.905; 2 -2.464,0.635; 3 -2.464,-0.635; 4 -2.464,-1.905; 5 2.464,-1.905; 6 2.464,-0.635; 7 2.464,0.635; 8 2.464,1.905 | smd 2.007 x 2.997: 9 0,0
SOT95P290X145-5N = smd 1.473 x 0.559: 1 -1.194,0.94; 2 -1.194,0; 3 -1.194,-0.94; 4 1.194,-0.94; 5 1.194,0.94
SOT95P230X110-3N = smd 1.219 x 0.559: 1 -0.991,0.94; 2 -0.991,-0.94; 3 0.991,0
F09HP = drill 1.016 octagon: 1 -5.486,-1.27; 2 -2.743,-1.27; 3 0,-1.27; 4 2.743,-1.27; 5 5.486,-1.27; 6 -4.115,1.27; 7 -1.372,1.27; 8 1.372,1.27; 9 4.115,1.27 | drill 3.302 pad 5.08: G1 -12.522,0; G2 12.522,0
µZ_E = smd 0.5 x 2: 1 19.551,-25.061; 2 19.551,-20.661; 3 18.751,-25.061; 4 18.751,-20.661; 5 17.951,-25.061; 6 17.951,-20.661; 7 17.151,-25.061; 8 17.151,-20.661; 9 16.351,-25.061; 10 16.351,-20.661; 11 15.551,-25.061; 12 15.551,-20.661; 13 14.751,-25.061; 14 14.751,-20.661; 15 13.951,-25.061; 16 13.951,-20.661; 17 13.151,-25.061; 18 13.151,-20.661; 19 12.351,-25.061; 20 12.351,-20.661; 21 11.551,-25.061; 22 11.551,-20.661; 23 10.751,-25.061; 24 10.751,-20.661; 25 9.951,-25.061; 26 9.951,-20.661; 27 9.151,-25.061; 28 9.151,-20.661; 29 8.351,-25.061; 30 8.351,-20.661; 31 7.551,-25.061; 32 7.551,-20.661; 33 6.751,-25.061; 34 6.751,-20.661; 35 5.951,-25.061; 36 5.951,-20.661; 37 5.151,-25.061; 38 5.151,-20.661; 39 4.351,-25.061; 40 4.351,-20.661; 41 3.551,-25.061; 42 3.551,-20.661; 43 2.751,-25.061; 44 2.751,-20.661; 45 1.951,-25.061; 46 1.951,-20.661; 47 1.151,-25.061; 48 1.151,-20.661; 49 0.351,-25.061; 50 0.351,-20.661; 51 -0.449,-25.061; 52 -0.449,-20.661; 53 -1.249,-25.061; 54 -1.249,-20.661; 55 -2.049,-25.061; 56 -2.049,-20.661; 57 -2.849,-25.061; 58 -2.849,-20.661; 59 -3.649,-25.061; 60 -3.649,-20.661; 61 -4.449,-25.061; 62 -4.449,-20.661; 63 -5.249,-25.061; 64 -5.249,-20.661; 65 -6.049,-25.061; 66 -6.049,-20.661; 67 -6.849,-25.061; 68 -6.849,-20.661; 69 -7.649,-25.061; 70 -7.649,-20.661; 71 -8.449,-25.061; 72 -8.449,-20.661; 73 -9.249,-25.061; 74 -9.249,-20.661; 75 -10.049,-25.061; 76 -10.049,-20.661; 77 -10.849,-25.061; 78 -10.849,-20.661; 79 -11.649,-25.061; 80 -11.649,-20.661; 81 -12.449,-25.061; 82 -12.449,-20.661; 83 -13.249,-25.061; 84 -13.249,-20.661; 85 -14.049,-25.061; 86 -14.049,-20.661; 87 -14.849,-25.061; 88 -14.849,-20.661; 89 -15.649,-25.061; 90 -15.649,-20.661; 91 -16.449,-25.061; 92 -16.449,-20.661; 93 -17.249,-25.061; 94 -17.249,-20.661; 95 -18.049,-25.061; 96 -18.049,-20.661; 97 -18.849,-25.061; 98 -18.849,-20.661; 99 -19.649,-25.061; 100 -19.649,-20.661; 101 19.551,19.391; 102 19.551,23.791; 103 18.751,19.391; 104 18.751,23.791; 105 17.951,19.391; 106 17.951,23.791; 107 17.151,19.391; 108 17.151,23.791; 109 16.351,19.391; 110 16.351,23.791; 111 15.551,19.391; 112 15.551,23.791; 113 14.751,19.391; 114 14.751,23.791; 115 13.951,19.391; 116 13.951,23.791; 117 13.151,19.391; 118 13.151,23.791; 119 12.351,19.391; 120 12.351,23.791; 121 11.551,19.391; 122 11.551,23.791; 123 10.751,19.391; 124 10.751,23.791; 125 9.951,19.391; 126 9.951,23.791; 127 9.151,19.391; 128 9.151,23.791; 129 8.351,19.391; 130 8.351,23.791; 131 7.551,19.391; 132 7.551,23.791; 133 6.751,19.391; 134 6.751,23.791; 135 5.951,19.391; 136 5.951,23.791; 137 5.151,19.391; 138 5.151,23.791; 139 4.351,19.391; 140 4.351,23.791; 141 3.551,19.391; 142 3.551,23.791; 143 2.751,19.391; 144 2.751,23.791; 145 1.951,19.391; 146 1.951,23.791; 147 1.151,19.391; 148 1.151,23.791; 149 0.351,19.391; 150 0.351,23.791; 151 -0.449,19.391; 152 -0.449,23.791; 153 -1.249,19.391; 154 -1.249,23.791; 155 -2.049,19.391; 156 -2.049,23.791; 157 -2.849,19.391; 158 -2.849,23.791; 159 -3.649,19.391; 160 -3.649,23.791; 161 -4.449,19.391; 162 -4.449,23.791; 163 -5.249,19.391; 164 -5.249,23.791; 165 -6.049,19.391; 166 -6.049,23.791; 167 -6.849,19.391; 168 -6.849,23.791; 169 -7.649,19.391; 170 -7.649,23.791; 171 -8.449,19.391; 172 -8.449,23.791; 173 -9.249,19.391; 174 -9.249,23.791; 175 -10.049,19.391; 176 -10.049,23.791; 177 -10.849,19.391; 178 -10.849,23.791; 179 -11.649,19.391; 180 -11.649,23.791; 181 -12.449,19.391; 182 -12.449,23.791; 183 -13.249,19.391; 184 -13.249,23.791; 185 -14.049,19.391; 186 -14.049,23.791; 187 -14.849,19.391; 188 -14.849,23.791; 189 -15.649,19.391; 190 -15.649,23.791; 191 -16.449,19.391; 192 -16.449,23.791; 193 -17.249,19.391; 194 -17.249,23.791; 195 -18.049,19.391; 196 -18.049,23.791; 197 -18.849,19.391; 198 -18.849,23.791; 199 -19.649,19.391; 200 -19.649,23.791 | hole 1.1: -22.149,-22.861; -22.149,21.591 | hole 0.7: 22.051,-22.861; 22.051,21.591

### Placement (x,y rotation side)
C1  93.19,26.67 0 top
C2  71.28,25.08 0 top
C3  65.41,8.57 270 top
C4  31.11,8.57 270 top
C5  60.48,24.13 270 top
C6  69.37,16.03 180 top
C7  63.02,29.84 270 top
C8  53.98,8.57 270 top
C9  42.55,8.57 270 top
C10  51.28,38.1 90 top
C11  49.37,38.1 90 top
C12  41.59,44.61 90 top
C13  43.81,44.61 90 top
C14  46.51,33.34 0 top
C15  46.83,26.67 180 top
C16  38.26,28.89 0 top
D1  19.68,6.19 270 top
D2  74.77,17.46 90 top
D3  42.07,40.96 180 top
D4  16.83,53.82 90 top
D5  62.87,64.14 270 top
JP1  102.39,33.34 270 top
JP2  108.74,33.34 270 top
JP3  14.29,30 180 top
JP4  7.94,43.18 90 top
JP5  96.04,33.34 270 top
JP6  108.27,23.02 180 top
JP7  111.44,83.19 90 top
JP8  111.44,52.07 90 top
L1  70.64,32.7 180 top
L2  49.21,42.23 180 top
LG1  29.69,23.5 180 top
LG2  32.86,23.5 180 top
LR1  29.37,36.51 0 top
LR2  27.15,36.51 0 top
LR3  33.81,36.51 0 top
LR4  31.59,36.51 0 top
Q1  99.54,23.5 270 top
Q2  26.83,42.23 180 top
Q3  23.34,42.23 180 top
Q4  33.81,42.23 180 top
Q5  30.32,42.23 180 top
R1  88.9,27.46 180 top
R2  88.9,29.69 180 top
R3  95.09,28.89 180 top
R4  53.18,22.86 90 top
R5  103.66,20.32 180 top
R6  101.12,27.3 270 top
R7  98.27,27.3 90 top
R8  55.4,22.23 90 top
R9  37.15,39.21 0 top
R10  37.94,42.23 270 top
R11  96.36,58.74 180 top
R12  96.36,56.83 180 top
R13  96.36,61.28 180 top
R14  96.36,63.18 180 top
R15  96.36,54.93 180 top
R16  96.36,53.02 180 top
R17  96.36,65.09 180 top
R18  96.36,66.99 180 top
R19  96.36,51.12 180 top
R20  96.36,49.21 180 top
R21  96.36,68.9 180 top
R22  96.36,70.8 180 top
R23  96.36,47.31 180 top
R24  96.36,45.4 180 top
R25  96.36,72.71 180 top
R26  96.36,74.61 180 top
R27  96.36,43.5 180 top
R28  42.39,33.66 0 top
R29  96.36,41.59 180 top
R30  96.36,76.52 180 top
R31  96.36,78.42 180 top
R32  50.32,25.72 90 top
R33  96.36,39.69 180 top
R34  42.39,31.43 180 top
R35  96.36,37.78 180 top
R36  96.36,80.33 180 top
R37  96.36,82.23 180 top
R38  42.39,26.04 180 top
R39  50.32,29.84 270 top
R40  50.16,33.5 90 top
R41  42.39,28.26 180 top
R42  29.69,27.94 270 top
R43  29.21,31.91 90 top
R44  26.99,31.91 90 top
R45  17.78,49.69 90 top
R46  15.56,49.69 270 top
R47  32.86,27.94 270 top
R48  33.66,31.91 90 top
R49  31.43,31.91 90 top
R50  61.59,67.94 270 top
R51  63.82,67.94 90 top
SW1  13.34,15.88 180 top
U1  92.08,23.02 0 top
U2  66.99,20.8 270 top
U3  46.35,38.26 0 top
U4  46.83,29.84 0 top
U5  37.94,32.07 270 top
X1  94.93,15.56 180 top
µZ1  56.83,75.72 0 top

### Tracks (layer width: path | path; a pad name or v marks a point on that pad's centre or on a via)
2V5_REF
  Top 0.406: C16.1 37,29.3 U5.2 U5.1 40.84,33.06 R28.1 41.44,34.45 41.91,34.92 44.45,34.92 44.77,34.61 50,34.61 R40.2
+3V3  (via drill 0.6)
  Top 0.305: µZ1.80 45.18,54.58 45.59,54.58 45.59,55.4
  Top 0.406: 98.58,24.59 Q1.1 98.27,24.61 | R7.1 98.27,24.61 | 98.27,24.61 96.99,24.61 96.52,25.08 96.52,26.04 96.2,26.04 96.2,26.19 | U1.3 91.28,22.38 91.44,22.54 91.44,23.18 93.03,24.77 93.03,25.4 93.19,25.56 93.34,25.56 93.5,25.72 93.66,25.72 94.04,26.09 | v96.2,26.99 96.2,26.19 | µZ1.78 45.98,55.24 45.72,55.24 45.72,55.06 µZ1.80 | R42.1 29.69,30.16 R43.1 | C1.2 94.04,26.09 | 94.04,26.09 96.1,26.09 96.2,26.19 | 35.24,35.88 35.56,35.56 v37.15,35.56 | v56.2,40.01 v74.3,40.01
  Top 0.508: µZ1.79 µZ1.80 | 45.18,60.7 45.56,60.33 | µZ1.179 45.18,95.89 µZ1.180 | µZ1.180 µZ1.178 | µZ1.198 37.98,100.85 38.42,101.28 45.09,101.28 45.18,101.18 µZ1.180
  Top 0.61: 36.2,45.4 R9.1 | R9.1 | R9.1 36.2,37.78 35.24,36.83 35.24,35.88 35.24,31.43 34.92,31.11 33.81,31.11 R48.1 R49.1 R43.1 R44.1 | 45.18,93.66 45.18,95.89
  Top 0.813: 45.18,60.7 45.18,93.66
  Top 1.27: L2.P$2 45.56,44.93 45.09,45.4 41.91,45.4 | 41.91,45.4 36.2,45.4 32.07,49.53 32.07,56.52 35.88,60.33 45.56,60.33 45.56,54.67 45.59,54.67 45.59,55.4 45.59,56.1 | C12.2 C13.2 41.97,45.46 41.91,45.4
  Bottom 0.406: v96.2,26.99 91.12,26.99 90.17,26.04 81.6,26.04 74.3,33.34 v74.3,40.01 | v37.15,35.56 41.59,40.01 v56.2,40.01
+5V  (via drill 0.6)
  Top 0.406: µZ1.57 53.98,50.79 53.98,50.8 53.32,50.8 µZ1.59 µZ1.60 53.84,55.06 53.98,54.93 53.98,55.09 | 53.98,55.09 53.98,55.24 | 53.53,99.25 53.27,99.52 µZ1.160 µZ1.158 | 53.53,99.25 53.53,98.23 53.56,98.2 53.56,96.39 53.59,96.36 53.98,96.36 µZ1.157 | 53.59,50.42 53.59,55.24 53.34,55.24 53.52,55.06 µZ1.58 53.98,55.08 53.98,55.09 | µZ1.159 53.59,95.11 53.59,95.54 | 53.53,99.25 53.53,100.84 53.98,101.28 72.07,101.28 72.39,100.97 72.39,99.52 µZ1.112 | 53.44,41.43 53.59,41.27 | 52.86,39.21 53.18,38.89 53.34,38.73 | 53.44,27.46 53.59,27.3 | 53.6,75.56 53.59,75.56 | R32.1 51.76,24.77 53.66,26.67 | R47.1 v31.43,28.89 | R50.1 53.6,68.89 53.59,68.9 | R6.1 101.12,31.91 101.28,32.07 | R45.1 17.78,45.09 17.94,44.93 | R4.2 53.18,25.24 53.66,25.72
  Top 0.813: U3.5 52.39,39.2 | 52.39,39.2 53.18,39.2 53.18,38.89 | 52.86,39.21 53.02,39.21 53.02,38.73 47.94,38.73 47.62,39.05 49.27,39.05 C11.2 | C10.2 52.14,38.95 52.39,39.2
  Top 1.016: JP4.2 17.46,44.45 17.94,44.93 18.41,45.4 v20,45.4
  Top 1.27: 53.66,38.42 87.95,38.42 94.3,32.07 JP5.P$2 101.28,32.07 JP1.P$2 JP2.P$2 | 54.61,26.67 54.61,26.99 54.93,27.3 61.91,27.3 | 61.91,27.3 62.23,27.3 65.09,30.16 65.41,30.16 | 65.41,30.16 66.67,30.16 66.67,29.84 62.55,25.72 53.66,25.72 53.02,26.35 60.67,26.35 | 61.91,26.35 62.23,26.35 62.55,26.67 62.87,26.67 65.41,29.21 64.77,29.21 61.91,26.35 | 61.91,26.35 60.67,26.35 | 60.67,26.35 C5.1 | L1.P$2 65.69,30.45 65.41,30.16 | C7.2 63.02,28.42 61.91,27.3
  Top 1.295: 53.59,99.89 53.59,96.36 53.59,95.54 53.59,75.56 53.59,68.9 53.59,50.42 53.59,41.27 53.59,27.69 | 53.59,27.3 53.59,27.69 | 53.59,27.69 54.61,26.67
  Top 1.524: 53.51,36.98 53.66,36.83 | 53.66,38.73 53.34,38.73
  Top 2.54: 54.61,26.67 53.66,26.67 53.66,36.83 53.66,38.42 53.66,38.73 v53.66,45.4 53.66,47.62
  Bottom 0.406: 31.43,45.4 31.27,45.24 31.43,45.09 v31.43,28.89
  Bottom 1.016: v20,45.4 31.43,45.4 v53.66,45.4
GND  (via drill 0.6, 1.5 pad 1.78)
  Top 0.305: C11.1 C10.1
  Top 0.406: 50.27,48.05 50.8,48.58 50.8,50.65 µZ1.65 50.78,53.02 | 50.16,30.48 50.16,30.8 50.17,30.8 R39.1 49.85,30.8 48.9,29.84 46.77,29.84 | 46.77,29.84 U4.2 41.44,29.84 R41.2 | C14.1 45.66,32.44 46.83,31.27 46.83,29.88 46.77,29.84 | R34.2 R41.2 | R41.2 41.44,28.89 C16.2 | U5.3 38.14,31.08 39.05,30.16 39.05,28.95 C16.2 | 39.55,41.28 D3.A | R10.1 39.05,43.18 40.64,41.59 | U3.2 46.2,38.26 46.35,38.1 46.35,35.4 48.9,35.4 48.9,36.77 48.95,36.83 | 48.9,36.83 48.95,36.83 | 48.95,36.83 C11.1 | 70.8,50.64 µZ1.15 70.78,53.02 | LG1.C LG2.C 33.56,22.45 33.97,22.86 33.97,25.72 35.88,27.62 38.73,27.62 39.05,27.94 39.05,28.84 C16.2 | µZ1.96 38.78,52.7 | 38.78,52.7 38.78,51.17 38.73,51.12 38.73,50.71 µZ1.95 | µZ1.86 v42.78,53.02 µZ1.85 42.78,52.7 38.78,52.7 | µZ1.77 45.98,52.65 46.35,53.02 v46.67,53.02 50.78,53.02 | µZ1.72 µZ1.71 | 50.78,53.02 µZ1.66 | µZ1.51 56.38,53.02 | v51.44,53.02 50.78,53.02 | µZ1.52 56.38,53.02 | 56.38,53.02 v56.2,53.02 58.78,53.02 | µZ1.45 58.78,53.02 | 58.78,53.02 µZ1.46 | 61.18,53.02 58.78,53.02 | µZ1.39 61.18,53.02 | µZ1.40 61.18,53.02 | µZ1.16 70.78,53.02 | 70.78,53.02 68.38,53.02 | 68.38,53.02 65.98,53.02 | 65.98,53.02 63.58,53.02 | 63.58,53.02 61.18,53.02 | µZ1.22 68.38,53.02 | µZ1.21 68.38,53.02 | µZ1.27 65.98,53.02 | µZ1.28 65.98,53.02 | µZ1.34 63.58,53.02 | µZ1.33 63.58,53.02 | µZ1.192 40.38,97.47 | 40.38,97.47 µZ1.191 | 42.78,97.47 v42.86,97.47 | µZ1.177 45.98,97.1 v46.35,97.47 48.38,97.47 | 42.78,97.47 µZ1.185 | µZ1.186 42.78,97.47 | 42.78,97.47 40.38,97.47 | µZ1.171 48.38,97.47 | µZ1.172 48.38,97.47 | 50.78,97.47 48.38,97.47 | µZ1.165 50.78,97.47 | µZ1.166 50.78,97.47 | 50.78,97.47 v51.44,97.47 | v56.2,97.47 56.52,97.47 | µZ1.152 56.38,97.47
  Top 0.406: µZ1.151 56.38,97.47 | 56.38,97.47 v56.2,97.47 | µZ1.146 58.78,97.47 | 58.78,97.47 v56.2,97.47 | µZ1.145 58.78,97.47 | µZ1.140 61.18,97.47 | 61.18,97.47 58.78,97.47 | µZ1.139 61.18,97.47 | µZ1.134 63.58,97.47 | 63.58,97.47 61.18,97.47 | µZ1.133 63.58,97.47 | µZ1.128 65.98,97.47 | 65.98,97.47 63.5,97.47 | µZ1.127 65.98,97.47 | 65.98,97.47 68.38,97.47 µZ1.121 | µZ1.116 70.78,97.47 | 70.78,97.47 68.26,97.47 | µZ1.115 70.78,97.47 | U1.2 90.81,23.65 92.08,24.92 92.08,26.41 C1.1 | R46.2 15.56,48.58 15.4,48.42 | Q3.2 22.39,42.38 22.54,42.23 26.04,42.23 | 26.04,42.23 29.21,42.23 | 29.21,42.23 32.38,42.23 32.7,42.55 32.7,43.17 Q4.2 | Q5.2 29.37,42.39 29.21,42.23 | Q2.2 25.88,42.38 26.04,42.23 | U2.6 66.36,20.8
  Top 0.61: U3.2 42.57,38.26 D3.A | 40.01,41.27 40.32,41.27 43.18,38.42
  Top 1.016: JP4.1 12.06,41.91
  Top 1.27: C13.1 C12.1 41.59,42.55 40.64,41.59 40.32,41.27 | R8.1 58.74,21.27 60.33,22.86 | 60.33,22.86 60.64,22.86 | 60.33,22.86 59.37,22.86 59.37,20.32 61.28,20.32 61.28,23.18 59.37,23.18 59.37,21.91 60.01,21.27 | 60.01,21.27 62.55,21.27 63.02,20.8 | C5.2 60.45,21.72 60.01,21.27
  Top 2.032: U2.9 66.36,20.8 63.02,20.8
  Bottom 0.406: v42.78,53.02 v46.67,53.02 | v56.2,53.02 v51.44,53.02 | v46.35,97.47 v42.86,97.47 | v51.44,97.47 v56.2,97.47
  other vias: 66.99,20.8 18.41,39.05 16.19,39.05 14.29,41.91 11.75,39.37 12.06,36.51 12.06,34.29 12.06,32.07 12.06,29.84 16.83,31.11 16.83,28.89 19.68,31.11 19.68,28.89 22.54,31.11 22.54,28.89 63.18,18.73 60.96,18.73 58.74,18.73 56.52,18.73 54.29,18.73 52.07,18.73 33.34,5.4 33.34,2.86 45.09,5.4 45.09,2.86 56.52,5.4 56.52,2.86 67.94,5.4 67.94,2.86 105.41,29.21 111.76,29.53 111.76,34.92 105.09,36.2 99.38,36.2 83.5,56.52 41.27,64.45 38.42,64.45 70.48,92.39 64.14,92.39 49.21,92.39 41.27,92.39 49.85,57.47 57.15,57.47 40.64,57.47 40.96,48.26 47.31,48.26 57.47,47.94 73.03,11.11 75.25,11.11 77.47,11.11 58.42,29.84 62.55,34.92 70.8,33.02 67.31,26.04 78.74,24.77 79.06,35.24 40.01,36.2 48.58,43.18 39.69,43.5 41.59,20.64 43.81,20.64 46.04,20.64 87.63,56.52 25.72,76.52 10.48,76.2 10.48,97.47 32.7,90.17 95.25,98.11 9.53,58.1 20.32,61.28 7.3,33.34 9.53,33.34 9.53,30.8 7.3,30.8 7.94,3.49 3.81,12.7 83.82,3.17 106.05,3.17 113.98,13.02 114.3,50.8 114.3,80.96 91.76,19.37 38.73,53.02 61.91,53.02 70.8,53.02 66.99,53.02 62.87,97.47 75.25,97.47 69.22,97.47
  pour Bottom: 1.59,104.46 115.89,104.46 115.89,1.59 1.59,1.59
  pour Top: 1.59,104.46 115.89,104.46 115.89,1.59 1.59,1.59
LED1  (via drill 0.6)
  Top 0.406: µZ1.149 57.15,95.08 57.15,93.5 v56.67,93.03 | v43.81,79.69 24.29,60.16 Q3.1
  Bottom 0.406: v56.67,93.03 56.67,92.55 v43.81,79.69
LED2  (via drill 0.6)
  Top 0.406: µZ1.147 v57.98,91.64 | v43.81,77.79 27.78,61.75 Q2.1
  Bottom 0.406: v57.98,91.64 57.67,91.64 v43.81,77.79
LED3  (via drill 0.6)
  Top 0.406: µZ1.143 59.58,93.29 v59.27,92.97 | v43.81,75.88 29.21,61.28 29.21,47.31 31.27,45.25 Q5.1
  Bottom 0.406: v43.81,75.88 59.05,91.12 59.05,92.77 v59.27,92.97
LED4  (via drill 0.6)
  Top 0.406: µZ1.141 60.38,90.23 v60.33,90.17 | v43.81,73.66 30.48,60.33 30.48,48.26 34.61,44.13 34.61,43.48 Q4.1
  Bottom 0.406: v43.81,73.66 v60.33,90.17
N$1
  Top 0.406: R1.1 89.85,26.35 89.53,26.04 86.36,26.04 85.09,24.77 85.09,21.27 85.25,21.11 U1.4
N$2
  Top 0.406: R11.1 104.14,58.74 JP8.12
N$3
  Top 0.406: U1.6 96.68,22.38 96.84,22.23 96.84,21.59 97.68,20.75 X1.2
N$4
  Top 0.406: U1.1 90.65,24.92 91.12,25.4 91.12,28.89 90.81,29.21 90.33,29.21 R2.1
N$5
  Top 0.406: R22.2 80.96,70.8 66.78,56.62 µZ1.26
N$6
  Top 0.406: R21.2 80.01,68.9 67.63,56.52 67.63,55.11 µZ1.24
N$7
  Top 0.406: µZ1.25 66.78,49.1 69.85,46.04 91.12,46.04 94.3,49.21 R20.2
N$8
  Top 0.406: U1.7 93.19,23.65 92.71,23.18 92.71,20.32 94.93,20.32 96.3,18.95 X1.7
N$9  (via drill 0.6)
  Top 0.406: µZ1.102 76.38,100.83 76.52,100.97 80.49,100.97 80.8,100.65 80.8,93.98 80.17,93.34 78.42,93.34 77.15,92.08 v77.15,81.92 | R1.2 86.84,27.46 86.04,26.67 84.45,26.67 84.45,28.57 83.5,29.53 v83.03,29.53
  Bottom 0.406: v77.15,81.92 77.15,34.29 81.92,29.53 v83.03,29.53
N$10  (via drill 0.6)
  Top 0.406: µZ1.103 75.58,83.52 v75.56,81.92 | R2.2 87.47,29.69 v85.41,27.62
  Bottom 0.406: v75.56,81.92 75.56,33.97 81.92,27.62 v85.41,27.62
N$11
  Top 0.406: U2.1 68.9,23.55 C2.1
N$12
  Top 0.406: 69.53,18.1 69.13,18.1 U2.8
  Top 1.27: 70.73,20.56 D2.C 72.31,20.56 69.53,17.78 73.34,17.78 75.88,20.32 73.98,20.32 73.03,21.27 72.07,21.27 | 70.73,20.56 70.48,20.32 | 70.48,20.32 69.22,19.05 | 72.07,21.27 71.44,21.27 70.8,20.64 70.8,19.05 71.44,18.41 73.03,18.41 73.34,18.73 72.71,18.73 72.07,19.37 70.8,19.37 69.53,18.1 | L1.P$1 75.6,30.77 75.88,30.48 | 75.88,30.48 76.52,29.84 76.52,20.64 72.71,20.64 72.07,21.27 | C2.2 72.13,22.28 72.07,22.23 | 75.88,30.48 75.56,30.16 75.25,30.16 73.98,28.89 73.98,23.18 75.25,23.18 75.25,28.57 74.3,29.53 73.98,29.53 73.03,28.57 73.03,22.54 73.34,22.23 75.56,22.23 75.88,22.54 75.88,29.21 74.61,30.48 74.61,31.43 72.07,28.89 72.07,22.23 | 72.07,22.23 72.07,21.91 70.73,20.56 | 70.48,20.32 71.12,20.32 72.71,21.91 72.39,21.91 72.07,22.23
N$13
  Top 0.406: R50.2 61.59,65.25 D5.1
N$14
  Top 0.305: 43.81,41.88 43.91,41.97 45.62,41.97 45.62,41.59 | L2.P$1 46.2,41.12 45.72,41.59 | 44.45,39.08 43.81,39.72 43.81,40.13 43.94,40.13 43.97,40.1
  Top 0.61: U3.1 45.16,39.29 45.09,39.37 | 45.09,39.37 44.13,40.32 44.13,41.59 45.62,41.59 45.72,41.59 45.72,39.69 45.4,39.37 45.4,39.69 44.77,40.32 44.77,41.27 45.09,41.27 45.09,40.64 45.4,40.32 44.9,40.32 D3.C | 45.09,39.37 44.7,39.37 43.97,40.1
N$15
  Top 0.406: R28.2 R34.1 43.98,30.79 U4.1
N$16
  Top 0.406: R4.1 53.81,22.54 54.29,22.54 54.92,23.18 R8.2 55.88,23.18 57.15,24.45 63.9,24.45 U2.4
N$17  (via drill 0.6)
  Top 0.406: µZ1.107 73.98,93.34 v74.3,93.03 | R3.2 93.82,29.21 93.66,29.21 92.87,30 v92.87,31.27
  Bottom 0.406: v74.3,93.03 81.92,93.03 100.33,74.61 100.33,46.67 92.87,39.21 v92.87,31.27
N$18  (via drill 0.6)
  Top 0.406: R5.2 101.6,20.32 v101.28,20.64 | µZ1.108 73.98,101.61 v74.3,101.92
  Bottom 0.406: v101.28,20.64 101.28,74.93 81.6,94.61 81.6,98.58 80.8,99.38 76.83,99.38 v74.3,101.92
N$19
  Top 0.406: µZ1.23 67.63,50.62 67.63,49.21 70.17,46.67 89.85,46.67 94.3,51.12 R19.2
N$20
  Top 0.406: R5.1 107,20.32 107.95,21.27 107.95,22.7 JP6.2
N$21
  Top 0.406: R37.2 84.77,82.23 59.58,57.04 µZ1.44
N$22
  Top 0.406: R36.2 83.82,80.33 60.38,56.89 µZ1.42
N$23
  Top 0.406: µZ1.43 59.58,49 66.36,42.23 89.85,42.23 94.3,37.78 R35.2
N$24
  Top 0.406: µZ1.41 60.38,49.15 66.67,42.86 91.12,42.86 94.3,39.69 R33.2
N$25
  Top 0.406: R31.2 83.5,78.42 61.98,56.9 µZ1.38
N$26
  Top 0.406: R30.2 82.55,76.52 62.87,56.83 62.87,55.15 µZ1.36
N$27
  Top 0.406: µZ1.37 61.98,48.82 67.31,43.5 92.39,43.5 94.3,41.59 R29.2
N$28
  Top 0.406: µZ1.35 62.78,48.98 67.63,44.13 93.66,44.13 94.3,43.5 R27.2
N$29
  Top 0.406: R26.2 82.23,74.61 64.45,56.83 64.45,55.13 µZ1.32
N$30
  Top 0.406: R25.2 81.28,72.71 65.18,56.61 µZ1.30
N$31
  Top 0.406: µZ1.31 64.38,48.96 68.58,44.77 94.3,44.77 94.93,45.4 R24.2
N$32
  Top 0.406: µZ1.29 65.18,49.12 68.9,45.4 92.39,45.4 94.3,47.31 R23.2
N$33
  Top 0.406: JP7.1 103.5,61.28 R13.1
N$34
  Top 0.406: R12.1 104.78,56.83 JP8.11
N$35
  Top 0.406: JP7.2 102.87,63.18 R14.1
N$36
  Top 0.406: R15.1 105.41,54.93 JP8.10
N$37
  Top 0.406: JP7.3 102.23,65.09 R17.1
N$38
  Top 0.406: R16.1 106.05,53.02 JP8.9
N$39
  Top 0.406: JP7.4 101.6,66.99 R18.1
N$40
  Top 0.406: R19.1 106.68,51.12 JP8.8
N$41
  Top 0.406: JP7.5 100.97,68.9 R21.1
N$42
  Top 0.406: R20.1 107.31,49.21 JP8.7
N$43
  Top 0.406: JP7.6 100.33,70.8 R22.1
N$44
  Top 0.406: R23.1 107.95,47.31 JP8.6
N$45
  Top 0.406: R7.2 97.79,28.25 | R7.2 99.69,28.25 99.69,28.26 99.69,25.24 99.54,25.08 99.54,23.02 99.22,22.7 98.59,22.7 Q1.2 | R3.1 96.04,28.25 R7.2
N$46
  Top 0.406: Q1.3 105.25,23.5 JP6.3 | 100.81,23.66 Q1.3 | R6.2 101.12,23.98 Q1.3
N$48
  Top 0.406: R18.2 79.38,66.99 69.22,56.83 69.22,55.09 µZ1.20
N$49
  Top 0.406: R17.2 78.42,65.09 69.98,56.65 µZ1.18
N$50
  Top 0.406: R24.1 108.58,45.4 JP8.5
N$51
  Top 0.406: JP7.7 99.69,72.71 R25.1
N$52
  Top 0.406: JP7.8 99.06,74.61 R26.1
N$53
  Top 0.406: R27.1 109.22,43.5 JP8.4
N$54
  Top 0.406: R29.1 109.86,41.59 JP8.3
N$55
  Top 0.406: JP7.9 98.42,76.52 R30.1
N$56
  Top 0.406: JP7.10 102.55,83.19 102.55,82.23 98.74,78.42 R31.1
N$57
  Top 0.406: R33.1 110.49,39.69 JP8.2
N$58
  Top 0.406: µZ1.19 69.22,50.63 69.22,48.9 70.8,47.31 88.58,47.31 94.3,53.02 R16.2
N$59
  Top 0.406: µZ1.17 69.98,49.08 71.12,47.94 87.31,47.94 94.3,54.93 R15.2
N$60
  Top 0.406: R14.2 77.79,63.18 71.58,56.98 µZ1.14
N$61
  Top 0.406: R13.2 76.83,61.28 72.39,56.83 µZ1.12
N$62
  Top 0.406: µZ1.13 71.58,49.07 72.07,48.58 86.04,48.58 94.3,56.83 R12.2
N$63
  Top 0.406: µZ1.11 72.39,49.21 84.77,49.21 94.3,58.74 R11.2
N$64
  Top 0.406: R35.1 111.12,37.78 JP8.1
N$65
  Top 0.406: JP7.11 100.65,83.82 100.65,81.92 99.06,80.33 R36.1
N$66
  Top 0.406: JP7.12 99.69,85.41 99.69,82.87 99.06,82.23 R37.1
N$67
  Top 0.406: R45.2 17.78,52.72 D4.1
N$69
  Top 0.406: R47.2 LG2.A
N$71
  Top 0.406: R44.2 26.99,35.3 LR2.A
N$72
  Top 0.406: LG1.A R42.2
N$73
  Top 0.406: R43.2 29.21,35.3 LR1.A
N$74
  Top 0.406: R49.2 31.43,35.3 LR4.A
N$75
  Top 0.406: R48.2 33.66,35.3 LR3.A
N$76
  Top 0.406: Q4.3 LR3.C
N$77
  Top 0.406: Q2.3 26.83,40.1 LR1.C
N$78
  Top 0.406: Q3.3 23.96,41.13 26.99,38.1 26.99,37.72 LR2.C
N$79
  Top 0.406: Q5.3 30.32,38.83 LR4.C
N$80
  Top 0.406: U3.3 41.74,37.32 39.85,39.21 R9.2 38.1,41.12 R10.2
N$81
  Top 0.406: C15.2 43.97,26.67 | 43.97,26.67 R38.1 | 43.97,26.67 43.97,27.62 43.73,27.86 | 43.73,27.86 R41.1 | U4.3 44.78,28.91 43.73,27.86
N$93
  Top 1.27: 15.88,17.14 15.56,16.83 15.56,16.19 SW1.P$1 | JP3.P$1 20.16,24.92 22.54,22.54 22.54,18.1 19.05,14.61 12.06,14.61 12.06,22.86 15.88,26.67 15.88,25.08 13.02,22.23 | 13.02,22.23 14.29,22.23 | 14.29,22.23 15.56,23.5 20.95,23.5 22.23,22.23 14.29,22.23 | 13.02,22.23 12.7,21.91 21.27,21.91 22.23,20.95 13.34,20.95 12.7,20.32 | 12.7,20.32 12.7,20.95 | 12.7,20.32 12.7,20 21.27,20 21.59,19.68 21.59,20 22.23,20.64 22.23,19.37 21.59,18.73 21.27,18.73 20.95,19.05 12.7,19.05 12.7,18.1 13.02,18.1 | 21.27,18.1 13.02,18.1 | 13.02,18.1 12.38,17.46 20.64,17.46 20.95,17.14 20.32,17.14 19.05,15.88 13.97,15.88
  Top 1.905: SW1.P$1 13.97,15.88 SW1.P$3
PWR_EN  (via drill 0.6)
  Top 0.406: R51.1 63.82,64.28 D5.3 65.09,64.14 v65.56,64.61 | v74.14,52.86 74.61,52.86 74.77,52.7 74.77,50.67 µZ1.5
  Bottom 0.406: v74.14,52.86 65.56,61.44 v65.56,64.61
V+
  Top 1.27: SW1.P$2 8.26,15.88 7.3,16.83 | 7.3,16.83 7.3,17.14 9.84,17.14 9.84,13.51 D1.1 | 14.88,8.29 D1.2 14.78,3.81 13.02,3.81 | 7.3,16.83 7.3,8.57 10.16,5.71 | 13.02,3.81 12.06,3.81 10.16,5.71 | 13.02,3.81 8.26,8.57 8.26,16.83 9.21,16.83 9.53,16.51 9.53,8.89 13.65,4.76 13.65,7.62 13.97,7.94 9.84,12.06 9.84,9.84 10.48,9.21 10.48,8.89 12.7,6.67 12.7,7.62 13.02,7.94 12.38,7.94 10.16,10.16 10.16,5.71
VADJ_EN  (via drill 0.6)
  Top 0.406: C15.1 47.68,28.56 U4.4 | R32.2 R39.2 48.03,28.89 U4.4 | v47.4,36.35 47.4,37.33 U3.4 | U4.4 51.1,28.91 51.12,28.89 51.44,28.89 51.75,29.21 51.75,35.24 v51.44,35.56
  Bottom 0.406: v51.44,35.56 48.2,35.56 v47.4,36.35
VCCIO_EN  (via drill 0.6)
  Top 0.406: µZ1.110 73.18,101.44 72.39,102.23 33.02,102.23 15.56,84.77 15.56,53.99 D4.3 15.56,53.65 R46.1 15.4,50.48 14.45,50.48 13.97,50.01 13.97,47.47 v14.45,46.99 | R38.2 40.8,26.67 35.88,26.67 34.61,25.4 34.61,22.23 33.66,21.27 28.57,21.27 28.26,21.59 28.26,29.53 26.04,29.53 25.72,29.84 25.72,38.1 23.81,40.01 21.91,40.01 21.91,40.96 v19.05,43.81
  Bottom 0.406: v19.05,43.81 17.62,43.81 v14.45,46.99
VD  (via drill 0.6)
  Top 0.406: 48.26,30.8 48.26,30.79 U4.5 48.25,30.79 48.26,30.8 | 48.26,32.44 v48.26,32.07 48.26,30.8 | 48.26,32.44 C14.2 | R40.1 48.37,32.55 48.26,32.44 | v32.07,18.73 32.07,15.24 31.75,14.92
  Top 0.61: 67.63,16.51 U2.7
  Top 1.27: C9.1 42.26,14.39 | 42.26,14.39 42.23,14.61 41.91,14.92 | C4.1 31.11,14.61 30.8,14.92 | D1.3 28.06,12.06 28.26,12.06 24.77,8.57 24.45,8.57 24.77,8.26 25.08,8.26 29.21,12.38 28.26,13.34 28.26,13.65 23.5,8.89 24.77,7.62 24.77,6.67 30.48,12.38 28.57,14.29 27.3,14.29 21.91,8.89 21.59,8.89 24.45,6.03 24.45,5.4 31.43,12.38 32.7,12.38 25.4,5.08 25.4,4.13 20.95,8.57 20,8.57 26.35,14.92 30.8,14.92 | 65.41,14.29 C3.1 66.74,13.97 66.99,13.97 66.99,14.92 66.36,14.29 64.77,14.29 66.36,15.88 | C6.2 68.52,13.91 67.63,13.02 | 67.63,13.02 66.04,11.43 | 66.36,15.88 66.99,16.51 67.63,16.51 68.58,15.56 68.26,15.56 67.31,14.61 | 66.36,15.88 66.99,15.88 67.63,15.24 67.63,14.61 66.36,15.88 | 66.67,13.97 67.31,14.61 | 67.31,14.61 67.31,13.34 67.63,13.02 | 66.04,14.92 31.75,14.92 30.8,14.92 | 30.8,14.92 29.84,13.97 41.84,13.97 42.26,14.39
  Top 4.064: C3.1 C8.1 C9.1 C4.1
  Bottom 0.406: v48.26,32.07 45.4,32.07 v32.07,18.73

### Text on the board
tNames: L2 | L1
_tsilk: MicroZed PowerBoard Carrier Card | 2016 | 44 | 42 | 38 | 36 | 32 | 30 | 26 | 24 | 20 | 18 | 14 | 12 | JX1 | 11 | 13 | 17 | 19 | 23 | 25 | 29 | 31 | 5V Servo | 35 | 37 | GND | 41 | 43 | GND | GND | 5V | 5V | RX | TX | GND | +